# Altium project S7CAS-PLEIADES-CARTE-MERE_Pxx.PrjPcb (part 2 of 5)

## Sheet S7CAS-PLEIADES-CARTE-MERE_Pxx_DEBUG_USB.SchDoc
size Tabloid; SheetNumber: 8; SheetTotal: 17; Sheet_Name: DEBUG_USB; Size: 11x17
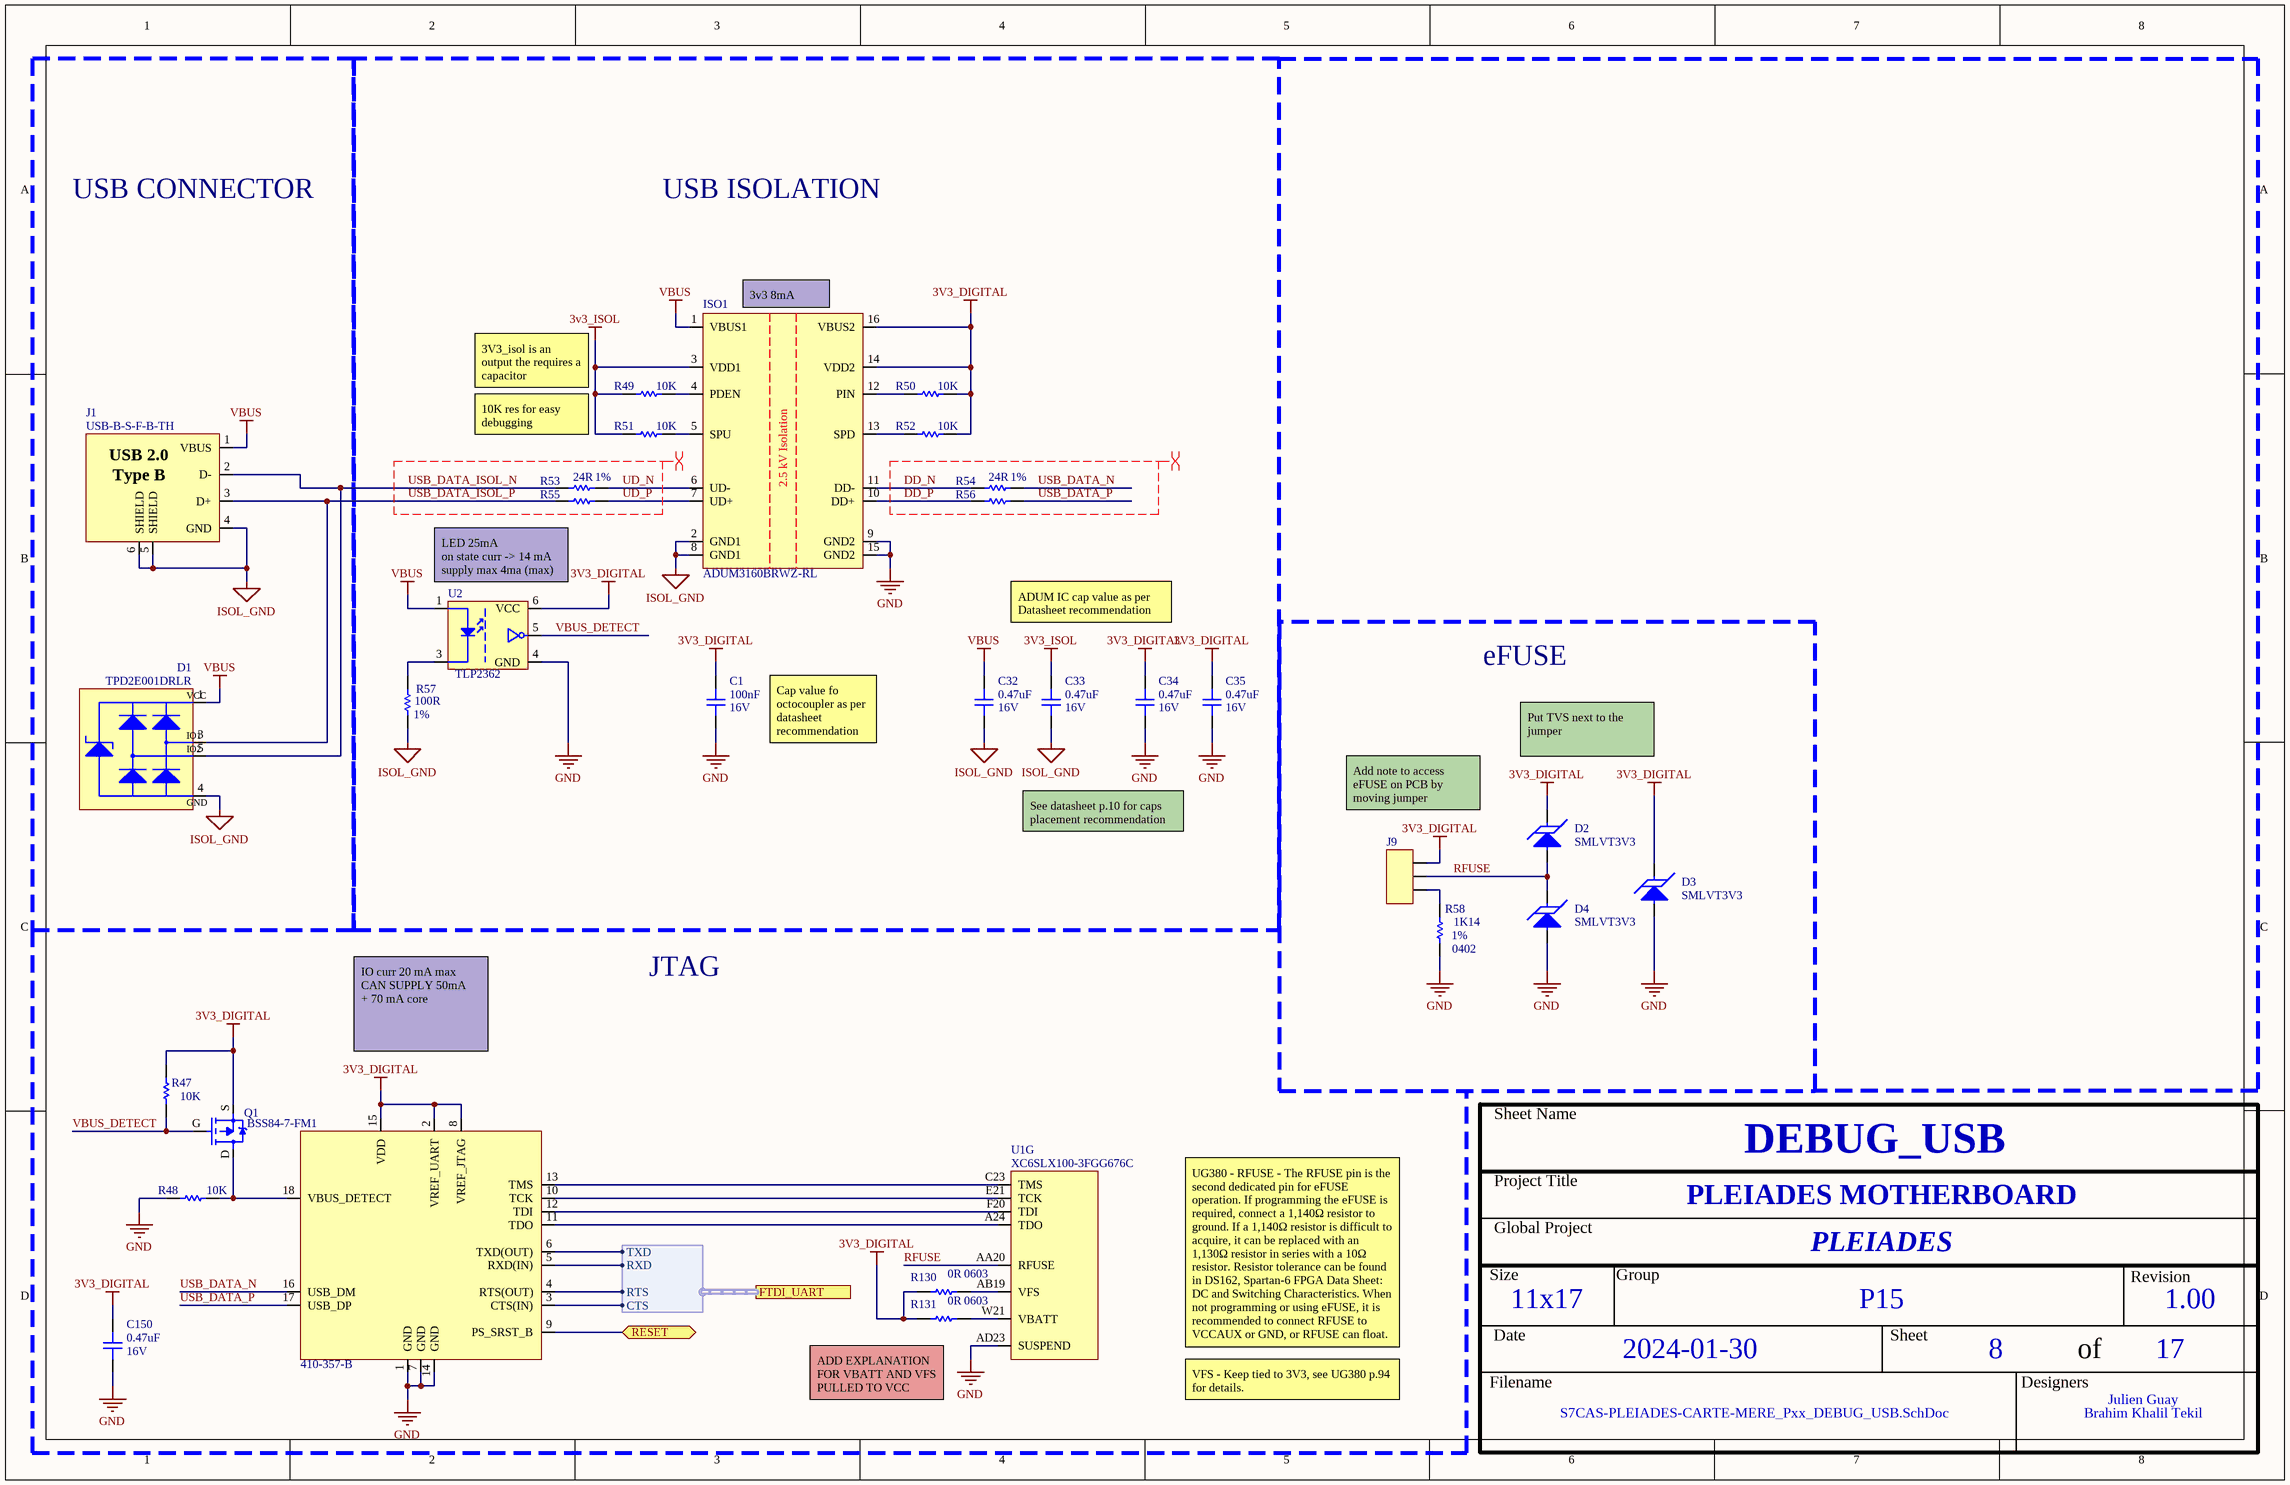
[diagram p6: S7CAS-PLEIADES-CARTE-MERE_Pxx_DEBUG_USB.SchDoc]

### Parts
C1  value 100nF  Voltage: 16V  [CAP_0603]  (hidden comment: CAP - 0603)
C32  value 0.47uF  Voltage: 16V  [CAP_0603]  (hidden comment: CAP - 0603)
C33  value 0.47uF  Voltage: 16V  [CAP_0603]  (hidden comment: CAP - 0603)
C34  value 0.47uF  Voltage: 16V  [CAP_0603]  (hidden comment: CAP - 0603)
C35  value 0.47uF  Voltage: 16V  [CAP_0603]  (hidden comment: CAP - 0603)
C150  value 0.47uF  Voltage: 16V  [CAP_0603]  (hidden comment: CAP - 0603)
D1  TPD2E001DRLR  [TVS_USB_TPD2E001DRLR]
D2  SMLVT3V3  [TVS_POW_SMLVT3V3]
D3  SMLVT3V3  [TVS_POW_SMLVT3V3]
D4  SMLVT3V3  [TVS_POW_SMLVT3V3]
ISO1  ADUM3160BRWZ-RL  [ISO_ADUM3160BRWZ-RL]
J1  USB-B-S-F-B-TH  [CON_USB_USB-B-S-F-B-TH]
J9  Part Number  [MALE HEADER - 1x3 2.54mm]  (value not drawn)
M1  410-357-B  [MOD_JTAG_410-357-B]
Q1  BSS84-7-F
R47  value 10K  [RES_0603]  (hidden comment: RES - 0603)
R48  value 10K  [RES_0603]  (hidden comment: RES - 0603)
R49  value 10K  [RES_0603]  (hidden comment: RES - 0603)
R50  value 10K  [RES_0603]  (hidden comment: RES - 0603)
R51  value 10K  [RES_0603]  (hidden comment: RES - 0603)
R52  value 10K  [RES_0603]  (hidden comment: RES - 0603)
R53  value 24R  Precision: 1%  [RES_0402]  (hidden comment: RES - 0402)
R54  value 24R  Precision: 1%  [RES_0402]  (hidden comment: RES - 0402)
R55  RES - 0402  [RES_0402]  (value not drawn)
R56  RES - 0402  [RES_0402]  (value not drawn)
R57  value 100R  Precision: 1%  [RES_0603]  (hidden comment: RES - 0603)
R58  value 1K14  Package: 0402  Precision: 1%  [RES_0402]  (hidden comment: RES - 0402)
R130  value 0R  Package: 0603  [RES_0603]  (hidden comment: RES - 0603)
R131  value 0R  Package: 0603  [RES_0603]  (hidden comment: RES - 0603)
U1  XC6SLX100-3FGG676C  [FPGA_XILINX_FGG676]  (part G of 10)
U2  TLP2362

### Blocks framed on the sheet
USB CONNECTOR: D1 J1
USB ISOLATION: C1 C32-C35 ISO1 R49-R57 U2
eFUSE: D2-D4 J9 R58

### Ports
FTDI_UART (harness FTDI_HARNESS, see S7CAS-PLEIADES-CARTE-MERE_Pxx_FPGA_bank2_4[6A]), RESET (bidir, see S7CAS-PLEIADES-CARTE-MERE_Pxx_FPGA_bank2_4[6C])

### Harnesses
FTDI_HARNESS: TXD, RXD, RTS, CTS

### Nets
3V3_DIGITAL: C1.2 C34.2 C35.2 C150.2 D2.K D3.K ISO1.14(VDD2) ISO1.16(VBUS2) J9.1 M1.2(VREF_UART) M1.8(VREF_JTAG) M1.15(VDD) Q1.S R47.2 R50.1 R52.1 R130.2 R131.2 U2.6(VCC)
3v3_ISOL: C33.2 ISO1.3(VDD1) R49.2 R51.2
GND: C1.1 C34.1 C35.1 C150.1 D3.A D4.A ISO1.9(GND2) ISO1.15(GND2) M1.1(GND) M1.7(GND) M1.14(GND) R48.1 R58.1 U1.AD23(SUSPEND) U2.4(GND)  [project net nCS]
ISOL_GND: C32.1 C33.1 D1.4(GND) ISO1.2(GND1) ISO1.8(GND1) J1.4(GND) J1.5(SHIELD) J1.6(SHIELD) R57.1
VBUS: C32.2 D1.1(VCC) ISO1.1(VBUS1) J1.1(VBUS) U2.1
DD_N: ISO1.11(DD-) R54.2
DD_P: ISO1.10(DD+) R56.2
PROGRAM_B: M1.9(PS_SRST_B) ; port RESET
RFUSE: D2.A D4.K J9.2 U1.AA20(RFUSE)
UD_N: ISO1.6(UD-) R53.1
UD_P: ISO1.7(UD+) R55.1
USB_DATA_ISOL_N: D1.5(IO2) J1.2(D-) R53.2
USB_DATA_ISOL_P: D1.3(IO1) J1.3(D+) R55.2
USB_DATA_N: M1.16(USB_DM) R54.1
USB_DATA_P: M1.17(USB_DP) R56.1
VBUS_DETECT: Q1.G R47.1 U2.5(vout)
NetISO1_4: ISO1.4(PDEN) R49.1
NetISO1_5: ISO1.5(SPU) R51.1
NetISO1_12: ISO1.12(PIN) R50.2
NetISO1_13: ISO1.13(SPD) R52.2
NetJ9_3: J9.3 R58.2
NetM1_3: M1.3(CTS(IN)) ; port FTDI_UART.CTS
NetM1_4: M1.4(RTS(OUT)) ; port FTDI_UART.RTS
NetM1_5: M1.5(RXD(IN)) ; port FTDI_UART.RXD
NetM1_6: M1.6(TXD(OUT)) ; port FTDI_UART.TXD
NetM1_10: M1.10(TCK) U1.E21(TCK)
NetM1_11: M1.11(TDO) U1.A24(TDO)
NetM1_12: M1.12(TDI) U1.F20(TDI)
NetM1_13: M1.13(TMS) U1.C23(TMS)
NetM1_18: M1.18(VBUS_DETECT) Q1.D R48.2
NetR57_2: R57.2 U2.3
NetR130_1: R130.1 U1.AB19(VFS)
NetR131_1: R131.1 U1.W21(VBATT)

Not connected (* = marked no-connect by the designer): D1 2(NC)

### Layout directives
differential pair; differential pair class USB_DATA_PAIR: UD_N, UD_P, USB_DATA_ISOL_N, USB_DATA_ISOL_P
differential pair: DD_N, DD_P, USB_DATA_N, USB_DATA_P

### Notes on the sheet
- (near ISO1) 3v3 8mA
- 3V3_isol is an output the requires a capacitor
- 10K res for easy debugging
- LED 25mA
  on state curr -> 14 mA
  supply max 4ma (max)
- ADUM IC cap value as per Datasheet recommendation
- Cap value fo octocoupler as per datasheet recommendation
- Put TVS next to the jumper
- See datasheet p.10 for caps placement recommendation
- Add note to access eFUSE on PCB by moving jumper
- JTAG
- IO curr 20 mA max
  CAN SUPPLY 50mA
  + 70 mA core
- UG380 - RFUSE - The RFUSE pin is the second dedicated pin for eFUSE operation. If programming the eFUSE is required, connect a 1,140Ω resistor to ground. If a 1,140Ω resistor is difficult to acquire, it can be replaced with an 1,130Ω resistor in series with a 10Ω resistor. Resistor tolerance can be found in DS162, Spartan-6 FPGA Data Sheet: DC and Switching Characteristics. When not programming or using eFUSE, it is recommended to connect RFUSE to VCCAUX or GND, or RFUSE can float.
- (near R131) ADD EXPLANATION FOR VBATT AND VFS PULLED TO VCC
- VFS - Keep tied to 3V3, see UG380 p.94 for details.
- Sheet Name
- Project Title
- Global Project
- Size
- Group
- Revision
- Date
- Sheet
- of
- Filename
- Designers
- (in symbol CON_USB_USB-B-S-F-B-TH) USB 2.0; Type B
- (in symbol ISO_ADUM3160BRWZ-RL) 2.5 kV Isolation

### Library data of the parts
C1 C32-C35 C150 = CAP - 0603: Precision: 10%; Current: *; CreatedBy: Jonathan Bouchard; Power: *; Package: 0603; Supplier 1: Arrow Electronics
  C1: Supplier Part Number 1: CL10B104KO8NNNC
  C32-C35 C150: Supplier Part Number 1: C1608X7R1C474K080AC
D1 = TVS_USB_TPD2E001DRLR: TVS - USB TVS DIODE 5.5V - SOT-553; Manufacturer #1: Texas Instruments; Value: 11V Breakdown; Voltage Rating: 5.5V (Max); GRAMS Lib Spec: 2.8; Magnetic Material: YES; Cryo: UNKNOWN; Tolerance: *; Current Rating: *; Power Max: *; HelpURL: http://www.ti.com/lit/ds/symlink/tpd2e001.pdf; CreatedBy/Date: Jonathan Bouchard 2018-07-10; VerifiedBy: Arnaud Samson 16-07-18; Temperature: -40°C ~ 85°C (TA); Package: SOT-553; Manufacturer #2: *; Note: *; Assembly Type: SMD; Part Number #2: *; Part Number #1: TPD2E001DRLR; Polarized: YES; Supplier 1: Digi-Key; Supplier Part Number 1: 296-21883-1-ND
D2-D4 = TVS_POW_SMLVT3V3: as D5 on sheet S7CAS-PLEIADES-CARTE-MERE_Pxx_FPGA_bank2_4; Tolerance: *; HelpURL: https://www.st.com/content/ccc/resource/technical/document/datasheet/da/a4/86/90/17/13/47/7c/CD00000923.pdf/files/CD00000923.pdf/jcr:content/translations/en.CD00000923.pdf; CreatedBy/Date: Jonathan Bouchard - 2019-04-27; VerifiedBy: Nicolas V. (2019-05-06); Temperature: -55°C ~ 175°C (TJ); Package: DO214AA; Manufacturer #2: *; Note: *; Assembly Type: SMD; Part Number #2: *; Part Number #1: SMLVT3V3; Supplier 1: Digi-Key; Supplier Part Number 1: 497-2496-1-ND; Cryo: UNKNOWN
ISO1 = ISO_ADUM3160BRWZ-RL: ISO - DGTL ISO 2.5KV 2CH USB - 16SOIC; Manufacturer #1: Analog Devices; Value: 2500Vrms voltage isolation; Voltage Rating: 3~5.5V; GRAMS Lib Spec: 2.8; Magnetic Material: UNKNOWN; Polarized: Yes; Tolerance: *; Current Rating: *; Power Max: *; HelpURL: https://www.analog.com/media/en/technical-documentation/data-sheets/ADuM3160.pdf; CreatedBy/Date: Tommy Rossignol 2018-11-16; VerifiedBy: Caroline Paulin - 13 février 2019; Temperature: -40°C ~ 105°C; Package: 16-SOIC; Manufacturer #2: *; Assembly Type: SMD; Part Number #2: *; Part Number #1: ADUM3160BRWZ-RL; Supplier 1: Digi-Key; Supplier Part Number 1: ADUM3160BRWZ-RLCT-ND; Cryo: UNKNOWN
J1 = CON_USB_USB-B-S-F-B-TH: CON - USB B RECPT TH R/A - 4-TH; Manufacturer #1: Samtec Inc.; Value: USB B; Voltage Rating: 30VAC; GRAMS Lib Spec: 2.8c; Magnetic Material: UNKNOWN; Polarized: YES; Tolerance: *; Current Rating: *; Power Max: *; HelpURL: http://suddendocs.samtec.com/catalog_english/usb_b.pdf; CreatedBy/Date: Jonathan Bouchard 2020-03-24; VerifiedBy: C.Paulin - 22/04/2020; Temperature: -50°C ~ 85°C; Package: 4-TH; Manufacturer #2: *; Note: *; Assembly Type: TH; Part Number #2: *; Part Number #1: USB-B-S-F-B-TH; Supplier 1: Digi-Key; Supplier Part Number 1: SAM10867-ND; Cryo: UNKNOWN
J9 = MALE HEADER - 1x3 2.54mm: MALE HEADER - 2.54mm 1x2; GRAMS Lib Spec: 2.7
M1 = MOD_JTAG_410-357-B: MOD - JTAG-SMT3-NC Programming Module For Xilinx FPGA - 18-SMT; Manufacturer #1: Digilent; Voltage Rating: VDD: 2.97V~3.63V, VJTAG/VUART: 1.65V~5.5V; GRAMS Lib Spec: 2.8; Note: Prior to reflow, the JTAG-SMT3-NC module must be dried at 125°C for 17 hours; Magnetic Material: Unknown; Polarized: Yes; Value: *; Tolerance: *; Current Rating: *; Power Max: *; HelpURL: https://reference.digilentinc.com/_media/reference/programmers/jtag-smt3/jtag-smt3-nc_rm.pdf; CreatedBy/Date: Tommy Rossignol 2018-11-23; VerifiedBy: Nicolas V. (2019-01-28); Temperature: -40°C ~ 85°C; Package: 18-pad SMT; Manufacturer #2: *; Assembly Type: SMD; Part Number #2: *; Part Number #1: 410-357-B; Supplier 1: Digi-Key; Supplier Part Number 1: 1286-1196-ND; Cryo: UNKNOWN
Q1 = MOS_P_CHANNEL: P-Channel  Enhancement Mode Field Effect Transistor; Current: [Current]; Mfr: *; Package / Case: *; Vds: *; Rds ON: *; Vgs: *; Operating Temperature: *; Supplier 1: Future Electronics; Supplier Part Number 1: 2984037
R47-R52 R130 R131 = RES - 0603: Precision: 1%; Current: *; CreatedBy: Jonathan Bouchard; Supplier 1: Arrow Electronics
  R47-R52: Package: 0603; Supplier Part Number 1: RMCF0603FT10K0
  R130 R131: Supplier Part Number 1: RMCF0603ZT0R00
R53 R54 R58 = RES - 0402: Voltage: 50V; Power: 1/16W; Current: *; CreatedBy: Jonathan Bouchard
  R53 R54: Package: 0402; Supplier 1: Arrow Electronics; Supplier Part Number 1: RC0402FR-0724RL
  R58: Supplier 1: Digikey; Supplier Part Number 1: 2019-RN73H1ETTP1141F50CT-ND
R55 R56 = RES - 0402: Voltage: 50V; Power: 1/16W; Precision: 1%; Value: 24R; Current: *; CreatedBy: Jonathan Bouchard; Package: 0402; Supplier 1: Arrow Electronics; Supplier Part Number 1: RC0402FR-0724RL
U1 = FPGA_XC6SLX100-3FGG676C: FPGA - XILINX SPARTAN 6 480 I/O - BGA-676; Voltage: 1.14 V ~ 1.26 V; Current: *; Power: *; Mfg: Xilinx; Mfg Part Number: XC6SLX100-3FGG676C; HelpURL: https://www.xilinx.com/support/documentation/data_sheets/ds162.pdf; CreatedBy: Jonathan Bouchard; Temperature: 0°C ~ 85°C (TJ); Value: *; Precision: *; Package: BGA-676; Supplier 1: Digikey; Supplier Part Number 1: 122-1760-ND
U2 = PHOTO_COUP_TLP2362: ISO - Logic Output Optoisolator 10MBd Open Collector 3750Vrms 1 Channel 20kV/µs CMTI 6-SO, 5 Lead; GRAMS Lib Spec: 2.7; Supplier 1: Arrow Electronics; Supplier Part Number 1: TLP2362(TPR,E
R57 = RES - 0603: Current: *; CreatedBy: Jonathan Bouchard; Package: 0603; Supplier 1: Arrow Electronics; Supplier Part Number 1: RMCF0603FT100R

## Sheet S7CAS-PLEIADES-CARTE-MERE_Pxx_PHY.SchDoc
size Tabloid; SheetNumber: 9; SheetTotal: 17; Sheet_Name: PHY; Size: 11x17
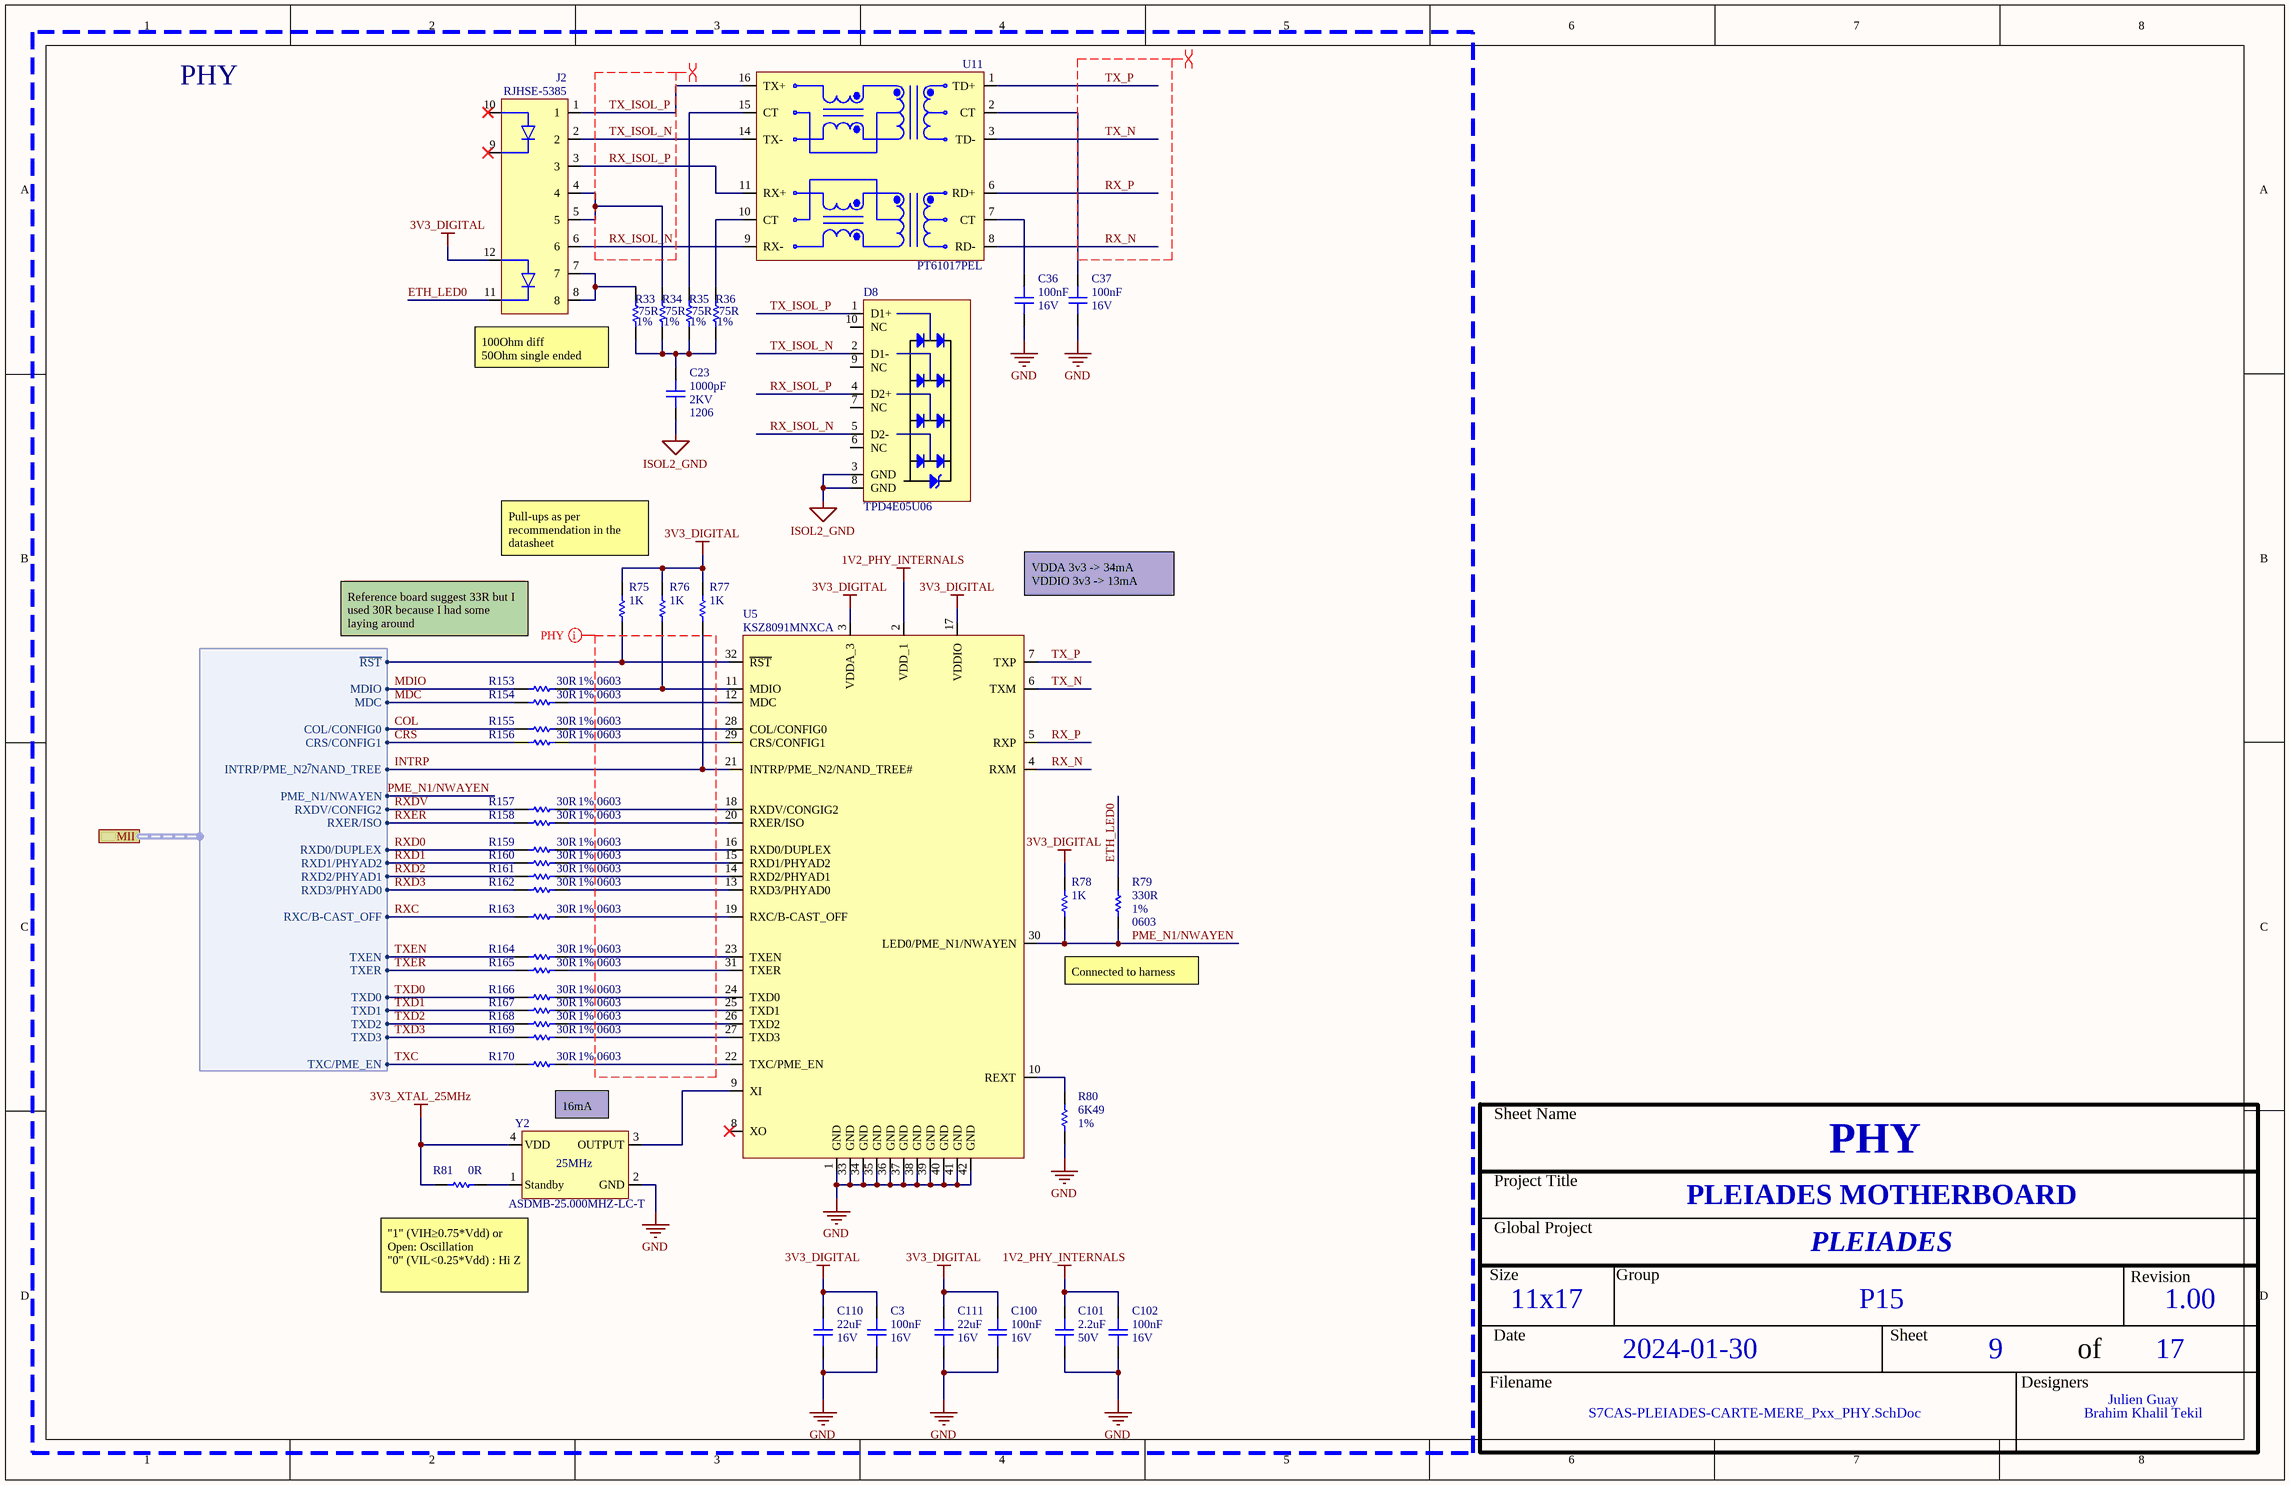
[diagram p7: S7CAS-PLEIADES-CARTE-MERE_Pxx_PHY.SchDoc]

### Parts
C3  value 100nF  Voltage: 16V  [CAP_0603]  (hidden comment: CAP - 0603)
C23  value 1000pF  Voltage: 2KV  Package: 1206  [CAP_1206]  (hidden comment: CAP - 1206)
C36  value 100nF  Voltage: 16V  [CAP_0603]  (hidden comment: CAP - 0603)
C37  value 100nF  Voltage: 16V  [CAP_0603]  (hidden comment: CAP - 0603)
C100  value 100nF  Voltage: 16V  [CAP_0603]  (hidden comment: CAP - 0603)
C101  value 2.2uF  Voltage: 50V  [CAP_0603]  (hidden comment: CAP - 0603)
C102  value 100nF  Voltage: 16V  [CAP_0603]  (hidden comment: CAP - 0603)
C110  value 22uF  Voltage: 16V  [CAP_1206]  (hidden comment: CAP - 1206)
C111  value 22uF  Voltage: 16V  [CAP_1206]  (hidden comment: CAP - 1206)
D8  TPD4E05U06  [TVS_DATA_TPD4E05U06]
J2  RJHSE-5385  [CONN_ETHERNET_RJHSE-5385]
R33  value 75R  Precision: 1%  [RES_0603]  (hidden comment: RES - 0603)
R34  value 75R  Precision: 1%  [RES_0603]  (hidden comment: RES - 0603)
R35  value 75R  Precision: 1%  [RES_0603]  (hidden comment: RES - 0603)
R36  value 75R  Precision: 1%  [RES_0603]  (hidden comment: RES - 0603)
R75  value 1K  [RES_0603]  (hidden comment: RES - 0603)
R76  value 1K  [RES_0603]  (hidden comment: RES - 0603)
R77  value 1K  [RES_0603]  (hidden comment: RES - 0603)
R78  value 1K  [RES_0603]  (hidden comment: RES - 0603)
R79  value 330R  Package: 0603  Precision: 1%  [RES_0603]  (hidden comment: RES - 0603)
R80  value 6K49  Precision: 1%  [RES_0402]  (hidden comment: RES - 0402)
R81  value 0R  [RES_0603]  (hidden comment: RES - 0603)
R153  value 30R  Package: 0603  Precision: 1%  [RES_0603]  (hidden comment: RES - 0603)
R154  value 30R  Package: 0603  Precision: 1%  [RES_0603]  (hidden comment: RES - 0603)
R155  value 30R  Package: 0603  Precision: 1%  [RES_0603]  (hidden comment: RES - 0603)
R156  value 30R  Package: 0603  Precision: 1%  [RES_0603]  (hidden comment: RES - 0603)
R157  value 30R  Package: 0603  Precision: 1%  [RES_0603]  (hidden comment: RES - 0603)
R158  value 30R  Package: 0603  Precision: 1%  [RES_0603]  (hidden comment: RES - 0603)
R159  value 30R  Package: 0603  Precision: 1%  [RES_0603]  (hidden comment: RES - 0603)
R160  value 30R  Package: 0603  Precision: 1%  [RES_0603]  (hidden comment: RES - 0603)
R161  value 30R  Package: 0603  Precision: 1%  [RES_0603]  (hidden comment: RES - 0603)
R162  value 30R  Package: 0603  Precision: 1%  [RES_0603]  (hidden comment: RES - 0603)
R163  value 30R  Package: 0603  Precision: 1%  [RES_0603]  (hidden comment: RES - 0603)
R164  value 30R  Package: 0603  Precision: 1%  [RES_0603]  (hidden comment: RES - 0603)
R165  value 30R  Package: 0603  Precision: 1%  [RES_0603]  (hidden comment: RES - 0603)
R166  value 30R  Package: 0603  Precision: 1%  [RES_0603]  (hidden comment: RES - 0603)
R167  value 30R  Package: 0603  Precision: 1%  [RES_0603]  (hidden comment: RES - 0603)
R168  value 30R  Package: 0603  Precision: 1%  [RES_0603]  (hidden comment: RES - 0603)
R169  value 30R  Package: 0603  Precision: 1%  [RES_0603]  (hidden comment: RES - 0603)
R170  value 30R  Package: 0603  Precision: 1%  [RES_0603]  (hidden comment: RES - 0603)
U5  KSZ8091MNXCA  [COM_ETH_PHY_KSZ8091MNXCA]
U11  PT61017PEL  [ISO_PT61017PEL]
Y2  ASDMB-25.000MHZ-LC-T  [OSC_ASDMB-25.000MHZ-LC-T]

### Blocks framed on the sheet
PHY: C3 C23 C36 C37 C100-C102 C110 C111 D8 J2 R33-R36 R75-R81 R153-R170 U5 U11 Y2

### Ports
MII (harness MII - Harness, see S7CAS-PLEIADES-CARTE-MERE_Pxx_FPGA_bank0_1_5[1B])

### Harnesses
MII - Harness: ~{RST}, MDIO, MDC, COL/CONFIG0, CRS/CONFIG1, INTRP/PME_N2~{/}NAND_TREE, PME_N1/NWAYEN, RXDV/CONFIG2, RXER/ISO, RXD0/DUPLEX, RXD1/PHYAD2, RXD2/PHYAD1, RXD3/PHYAD0, RXC/B-CAST_OFF, TXEN, TXER, TXD0, TXD1, TXD2, TXD3, TXC/PME_EN

### Nets
1V2_PHY_INTERNALS: C101.2 C102.2 U5.2(VDD_1)
3V3_DIGITAL: C3.2 C100.2 C110.2 C111.2 J2.12(LED2_A) R75.2 R76.2 R77.2 R78.2 U5.3(VDDA_3) U5.17(VDDIO)
3V3_XTAL_25MHz: R81.2 Y2.4(VDD)
GND: C3.1 C36.1 C37.1 C100.1 C101.1 C102.1 C110.1 C111.1 R80.1 U5.1(GND) U5.33(GND) U5.34(GND) U5.35(GND) U5.36(GND) U5.37(GND) U5.38(GND) U5.39(GND) U5.40(GND) U5.41(GND) U5.42(GND) Y2.2(GND)  [project net nCS]
ISOL2_GND: C23.1 D8.3(GND) D8.8(GND)
COL: R155.1 ; port MII.COL/CONFIG0
CRS: R156.1 ; port MII.CRS/CONFIG1
ETH_LED0: J2.11(LED2_K) R79.2
INTRP: R77.1 U5.21(INTRP/PME_N2/NAND_TREE#) ; port MII.INTRP/PME_N2~{/}NAND_TREE
MDC: R154.1 ; port MII.MDC
MDIO: R153.1 ; port MII.MDIO
PME_N1/NWAYEN: R78.1 R79.1 U5.30(LED0/PME_N1/NWAYEN) ; port MII.PME_N1/NWAYEN
RX_ISOL_N: D8.5(D2-) J2.6 U11.9(RX-)
RX_ISOL_P: D8.4(D2+) J2.3 U11.11(RX+)
RX_N: U5.4(RXM) U11.8(RD-)
RX_P: U5.5(RXP) U11.6(RD+)
RXC: R163.1 ; port MII.RXC/B-CAST_OFF
RXD0: R159.1 ; port MII.RXD0/DUPLEX
RXD1: R160.1 ; port MII.RXD1/PHYAD2
RXD2: R161.1 ; port MII.RXD2/PHYAD1
RXD3: R162.1 ; port MII.RXD3/PHYAD0
RXDV: R157.1 ; port MII.RXDV/CONFIG2
RXER: R158.1 ; port MII.RXER/ISO
TX_ISOL_N: D8.2(D1-) J2.2 U11.14(TX-)
TX_ISOL_P: D8.1(D1+) J2.1 U11.16(TX+)
TX_N: U5.6(TXM) U11.3(TD-)
TX_P: U5.7(TXP) U11.1(TD+)
TXC: R170.1 ; port MII.TXC/PME_EN
TXD0: R166.1 ; port MII.TXD0
TXD1: R167.1 ; port MII.TXD1
TXD2: R168.1 ; port MII.TXD2
TXD3: R169.1 ; port MII.TXD3
TXEN: R164.1 ; port MII.TXEN
TXER: R165.1 ; port MII.TXER
NetC23_2: C23.2 R33.1 R34.1 R35.1 R36.1
NetC36_2: C36.2 U11.7(CT)
NetC37_2: C37.2 U11.2(CT)
NetJ2_4: J2.4 J2.5 R34.2
NetJ2_7: J2.7 J2.8 R33.2
NetR35_2: R35.2 U11.15(CT)
NetR36_2: R36.2 U11.10(CT)
NetR75_1: R75.1 U5.32(~{RST}) ; port MII.~{RST}
NetR76_1: R76.1 R153.2 U5.11(MDIO)
NetR80_2: R80.2 U5.10(REXT)
NetR81_1: R81.1 Y2.1(Standby)
NetR154_2: R154.2 U5.12(MDC)
NetR155_2: R155.2 U5.28(COL/CONFIG0)
NetR156_2: R156.2 U5.29(CRS/CONFIG1)
NetR157_2: R157.2 U5.18(RXDV/CONGIG2)
NetR158_2: R158.2 U5.20(RXER/ISO)
NetR159_2: R159.2 U5.16(RXD0/DUPLEX)
NetR160_2: R160.2 U5.15(RXD1/PHYAD2)
NetR161_2: R161.2 U5.14(RXD2/PHYAD1)
NetR162_2: R162.2 U5.13(RXD3/PHYAD0)
NetR163_2: R163.2 U5.19(RXC/B-CAST_OFF)
NetR164_2: R164.2 U5.23(TXEN)
NetR165_2: R165.2 U5.31(TXER)
NetR166_2: R166.2 U5.24(TXD0)
NetR167_2: R167.2 U5.25(TXD1)
NetR168_2: R168.2 U5.26(TXD2)
NetR169_2: R169.2 U5.27(TXD3)
NetR170_2: R170.2 U5.22(TXC/PME_EN)
NetU5_9: U5.9(XI) Y2.3(OUTPUT)

Not connected (* = marked no-connect by the designer): D8 6(NC) 7(NC) 9(NC) 10(NC); J2 9(LED1_K)* 10(LED1_A)*; U5 8(XO)*

### Layout directives
differential pair; differential pair class ETH_DIFF_PAIR: RX_N, RX_P, TX_N, TX_P
differential pair; differential pair class ETH_ISOL_DIFF_PAIR: RX_ISOL_N, RX_ISOL_P, TX_ISOL_N, TX_ISOL_P
net class MII_TRANSMISSION_LINE: (no net found under the mark)

### Notes on the sheet
- 100Ohm diff
  50Ohm single ended
- Pull-ups as per recommendation in the datasheet
- Reference board suggest 33R but I used 30R because I had some laying around
- (near U5) VDDA 3v3 -> 34mA
  VDDIO 3v3 -> 13mA
- Connected to harness
- 16mA
- "1" (VIH≥0.75*Vdd) or Open: Oscillation
  "0" (VIL<0.25*Vdd) : Hi Z
- Sheet Name
- Project Title
- Global Project
- Size
- Group
- Revision
- Date
- Sheet
- of
- Filename
- Designers

### Library data of the parts
C3 C36 C37 C100-C102 = CAP - 0603: Precision: 10%; Current: *; CreatedBy: Jonathan Bouchard; Power: *; Package: 0603; Supplier 1: Arrow Electronics
  C3 C36 C37 C100 C102: Supplier Part Number 1: CL10B104KO8NNNC
  C101: Supplier Part Number 1: GRM188R61H225KE11D
C23 C110 C111 = CAP - 1206: Precision: 10%; Current: *; CreatedBy: Jonathan Bouchard; Power: *; Supplier 1: Arrow Electronics
  C23: Supplier Part Number 1: 1206GC102KAT1A
  C110 C111: Package: 1206; Supplier Part Number 1: CL31A226MOCLNNC
D8 = TVS_DATA_TPD4E05U06: TVS - TVS DIODE 5.5VWM 14VC - 10SON; Manufacturer #1: Texas Instruments; Part Number #1: TPD4E05U06DQAR; Current Rating: 2.5A (8/20µs); Power Max: 40 W (peak); Value: 4 unidirectionnal channels; Voltage rating: 6V (Breakdown); Polarized: YES; Magnetic Material: UNKNOWN; GRAMS Lib Spec: 2.8; Manufacturer #2: *; Part Number #2: *; HelpURL: http://www.ti.com/lit/ds/symlink/tpd4e05u06.pdf; Supplier 1: Digi-Key; Supplier Part Number 1: 296-35765-1-ND; Note: *; Assembly Type: SMD; Temperature: -40°C ~ 125°C; Package: 10-USON; CreatedBy/Date: Olivier Bernard / 12/3/2018; Tolerance: *; VerifiedBy: Caroline Paulin / 4 juillet 2018; Cryo: UNKNOWN
J2 = CONN_ETHERNET_RJHSE-5385: CONN - MOD JACK RJ45 R/A ETHERNET - TH; Mfg: Amphenol; Voltage: *; Current: *; Power: *; Mfg Part Number: RJHSE-5385; HelpURL: https://www.amphenolcanada.com/ProductSearch/drawings/AC/RJHSE538X.pdf; CreatedBy: Jonathan Bouchard; Temperature: -55°C ~ 85°C; Value: *; Precision: *; Package: TH-12; Supplier 1: Digikey; Supplier Part Number 1: RJHSE-5385-ND
R75-R78 R81 = RES - 0603: Precision: 1%; Current: *; CreatedBy: Jonathan Bouchard; Package: 0603; Supplier 1: Arrow Electronics
  R75-R78: Supplier Part Number 1: RMCF0603FT1K00
  R81: Supplier Part Number 1: RMCF0603ZT0R00
R80 = RES - 0402: Voltage: 50V; Power: 1/16W; Current: *; CreatedBy: Jonathan Bouchard; Package: 0402; Supplier 1: Mouser; Supplier Part Number 1: 652-CR0402-FX6491GLF
U5 = COM_ETH_PHY_KSZ8091MNXCA: COM - ETHERNET PHY 10/100 - QFN-32; Voltage: 1.8V, 2.5V, 3.3V; Mfg: Micrel; Current: *; Power: *; Mfg Part Number: KSZ8091MNXCA; HelpURL: http://ww1.microchip.com/downloads/en/DeviceDoc/00002275A.pdf; CreatedBy: Jonathan Bouchard; Temperature: 0°C ~ 70°C; Value: *; Precision: *; Package: QFN-32; Supplier 1: Digikey; Supplier Part Number 1: 576-4356-ND
U11 = ISO_PT61017PEL: ISO - 350µH LAN 10/100 Base-T Pulse Transformer 1CT:1CT Surface Mount; GRAMS Lib Spec: 2.7; Supplier 1: Arrow Electronics; Supplier Part Number 1: PT61017PEL
Y2 = OSC_ASDMB-25.000MHZ-LC-T: OSC - 25MHz XO (Standard) LVCMOS - 4-SMD, No Lead; Manufacturer #1: Abracon LLC; Tolerance: ±50ppm; Voltage Rating: 1.8V ~ 3.3V; GRAMS Lib Spec: 2.8; Magnetic Material: Unknown; Polarized: Yes; Value: 25MHz; Current Rating: *; Power Max: *; HelpURL: https://abracon.com/Oscillators/ASDMB.pdf; CreatedBy/Date: Joël Lemay 2019-03-29; VerifiedBy: C. Paulin - 29 mai 2019; Temperature: -40°C ~ +85°C; Package: 4-SMD, No Lead; Manufacturer #2: *; Note: *; Assembly Type: SMD; Part Number #2: *; Part Number #1: ASDMB-25.000MHZ-LC-T; Supplier 1: Digi-Key; Supplier Part Number 1: 535-11730-1-ND; Cryo: UNKNOWN
R33-R36 R79 R153-R170 = RES - 0603: Current: *; CreatedBy: Jonathan Bouchard
  R33-R36: Package: 0603; Supplier 1: Arrow Electronics; Supplier Part Number 1: RMCF0603FT75R0
  R153-R170: Supplier 1: Arrow Electronics; Supplier Part Number 1: RMCF0603FT30R0

## Sheet S7CAS-PLEIADES-CARTE-MERE_Pxx_FLASH_PHY_CLOCK.SchDoc
size Tabloid; SheetNumber: 10; SheetTotal: 18; Sheet_Name: FLASH CLOCK; Size: 11x17
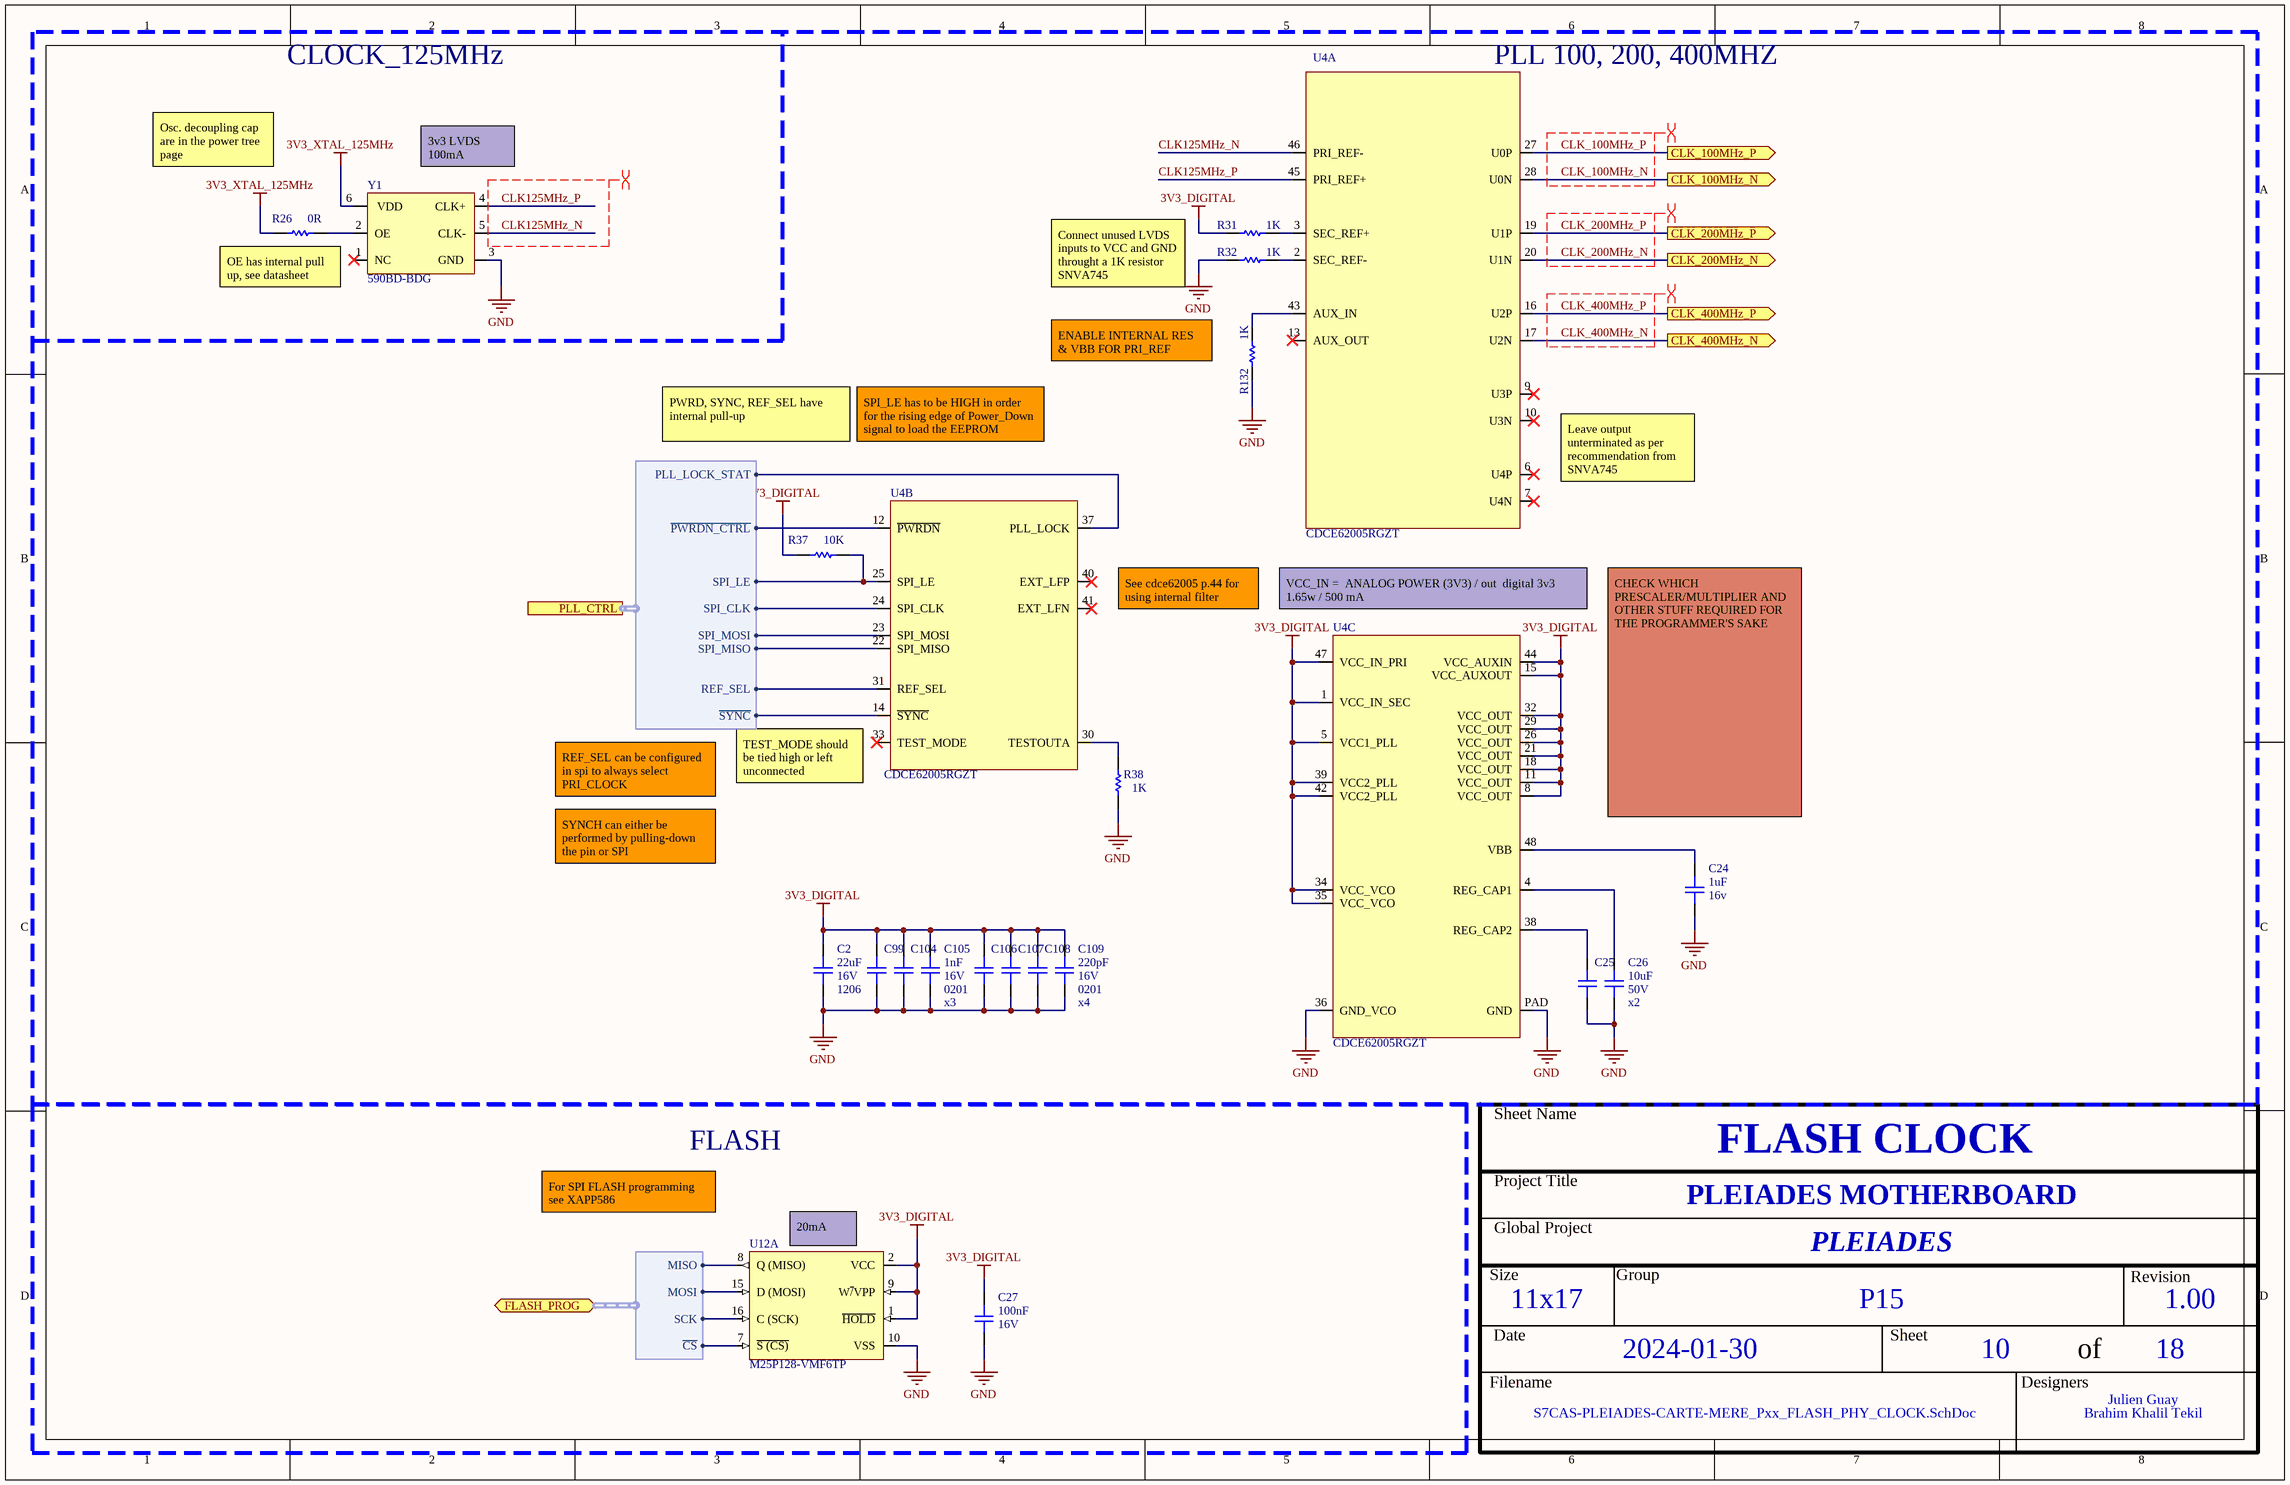
[diagram p8: S7CAS-PLEIADES-CARTE-MERE_Pxx_FLASH_PHY_CLOCK.SchDoc]

### Parts
C2  value 22uF  Voltage: 16V  Package: 1206  [CAP_1206]  (hidden comment: CAP - 1206)
C24  value 1uF  Voltage: 16v  [CAP_0603]  (hidden comment: CAP - 0603)
C25  CAP - 1206  [CAP_1206]  (value not drawn)
C26  value 10uF  Voltage: 50V  [CAP_1206]  (hidden comment: CAP - 1206)
C27  value 100nF  Voltage: 16V  [CAP_0603]  (hidden comment: CAP - 0603)
C99  CAP - 0201  [CAP_0201]  (value not drawn)
C104  CAP - 0201  [CAP_0201]  (value not drawn)
C105  value 1nF  Voltage: 16V  Package: 0201  [CAP_0201]  (hidden comment: CAP - 0201)
C106  CAP - 0201  [CAP_0201]  (value not drawn)
C107  CAP - 0201  [CAP_0201]  (value not drawn)
C108  CAP - 0201  [CAP_0201]  (value not drawn)
C109  value 220pF  Voltage: 16V  Package: 0201  [CAP_0201]  (hidden comment: CAP - 0201)
R26  value 0R  [RES_0603]  (hidden comment: RES - 0603)
R31  value 1K  [RES_0603]  (hidden comment: RES - 0603)
R32  value 1K  [RES_0603]  (hidden comment: RES - 0603)
R37  value 10K  [RES_0603]  (hidden comment: RES - 0603)
R38  value 1K  [RES_0603]  (hidden comment: RES - 0603)
R132  value 1K  [RES_0603]  (hidden comment: RES - 0603)
U4  CDCE62005RGZT  [TIM_CDCE62005RGZT]  (parts A,B,C of 3)
U12  M25P128-VMF6TP  [FLASH - M25P128-VMF6TP]  (part A of 2)
Y1  590BD-BDG  [OSC_590BD-BDG]

### Blocks framed on the sheet
FLASH: C27 U12

### Ports
CLK_100MHz_N (out, see S7CAS-PLEIADES-CARTE-MERE_Pxx_FPGA_bank0_1_5[3A]), CLK_100MHz_P (out, see S7CAS-PLEIADES-CARTE-MERE_Pxx_FPGA_bank0_1_5[3A]), CLK_200MHz_N (out, see S7CAS-PLEIADES-CARTE-MERE_Pxx_CAN[1C]), CLK_200MHz_P (out, see S7CAS-PLEIADES-CARTE-MERE_Pxx_CAN[1C]), CLK_400MHz_N (out, see S7CAS-PLEIADES-CARTE-MERE_Pxx_CNA[2C]), CLK_400MHz_P (out, see S7CAS-PLEIADES-CARTE-MERE_Pxx_CNA[2C]), FLASH_PROG (bidir, harness FLASH_PROG, see S7CAS-PLEIADES-CARTE-MERE_Pxx_FPGA_bank2_4[2D]), PLL_CTRL (harness PLL_CTRL, see S7CAS-PLEIADES-CARTE-MERE_Pxx_FPGA_bank0_1_5[1B])

### Harnesses
PLL_CTRL: ~{PWRDN_CTRL}, SPI_LE, SPI_CLK, SPI_MOSI, SPI_MISO, REF_SEL, ~{SYNC}, PLL_LOCK_STAT
FLASH_PROG: MISO, MOSI, SCK, ~{CS}

### Nets
3V3_DIGITAL: C2.2 C27.2 C99.2 C104.2 C105.2 C106.2 C107.2 C108.2 C109.2 R31.2 R37.2 U4.1(VCC_IN_SEC) U4.5(VCC1_PLL) U4.8(VCC_OUT) U4.11(VCC_OUT) U4.15(VCC_AUXOUT) U4.18(VCC_OUT) U4.21(VCC_OUT) U4.26(VCC_OUT) U4.29(VCC_OUT) U4.32(VCC_OUT) U4.34(VCC_VCO) U4.35(VCC_VCO) U4.39(VCC2_PLL) U4.42(VCC2_PLL) U4.44(VCC_AUXIN) U4.47(VCC_IN_PRI) U12.1(~{HOLD}) U12.2(VCC) U12.9(W~{/}VPP)
3V3_XTAL_125MHz: R26.2 Y1.6(VDD)
GND: C2.1 C24.1 C25.1 C26.1 C27.1 C99.1 C104.1 C105.1 C106.1 C107.1 C108.1 C109.1 R32.2 R38.1 R132.2 U4.36(GND_VCO) U4.PAD(GND) U12.10(VSS) Y1.3(GND)  [project net nCS]
CCLK: U12.16(C_(SCK)) ; port FLASH_PROG.SCK
CLK125MHz_N: U4.46(PRI_REF-) Y1.5(CLK-)
CLK125MHz_P: U4.45(PRI_REF+) Y1.4(CLK+)
CLK_100MHz_N: U4.28(U0N) ; port CLK_100MHz_N
CLK_100MHz_P: U4.27(U0P) ; port CLK_100MHz_P
CLK_200MHz_N: U4.20(U1N) ; port CLK_200MHz_N
CLK_200MHz_P: U4.19(U1P) ; port CLK_200MHz_P
CLK_400MHz_N: U4.17(U2N) ; port CLK_400MHz_N
CLK_400MHz_P: U4.16(U2P) ; port CLK_400MHz_P
CSO_B: U12.7(~{S_(CS)}) ; port FLASH_PROG.~{CS}
MOSI: U12.15(D_(MOSI)) ; port FLASH_PROG.MOSI
NetC24_2: C24.2 U4.48(VBB)
NetC25_2: C25.2 U4.38(REG_CAP2)
NetC26_2: C26.2 U4.4(REG_CAP1)
NetR26_1: R26.1 Y1.2(OE)
NetR31_1: R31.1 U4.3(SEC_REF+)
NetR32_1: R32.1 U4.2(SEC_REF-)
NetR37_1: R37.1 U4.25(SPI_LE) ; port PLL_CTRL.SPI_LE
NetR38_2: R38.2 U4.30(TESTOUTA)
NetR67_1: U12.8(Q_(MISO)) ; port FLASH_PROG.MISO
NetR132_1: R132.1 U4.43(AUX_IN)
NetU1_B8: U4.14(~{SYNC}) ; port PLL_CTRL.~{SYNC}
NetU1_C6: U4.37(PLL_LOCK) ; port PLL_CTRL.PLL_LOCK_STAT
NetU1_C8: U4.23(SPI_MOSI) ; port PLL_CTRL.SPI_MOSI
NetU1_D8: U4.24(SPI_CLK) ; port PLL_CTRL.SPI_CLK
NetU1_E8: U4.12(~{PWRDN}) ; port PLL_CTRL.~{PWRDN_CTRL}
NetU1_E9: U4.31(REF_SEL) ; port PLL_CTRL.REF_SEL
NetU1_F9: U4.22(SPI_MISO) ; port PLL_CTRL.SPI_MISO

Not connected (* = marked no-connect by the designer): U4 6(U4P)* 7(U4N)* 9(U3P)* 10(U3N)* 13(AUX_OUT)* 33(TEST_MODE)* 40(EXT_LFP)* 41(EXT_LFN)*; Y1 1(NC)*

### Layout directives
differential pair; differential pair class LVDS_125MHz; net class CLK_125MHz: CLK125MHz_N, CLK125MHz_P
differential pair; differential pair class CLK_100MHz_PAIR: CLK_100MHz_N, CLK_100MHz_P
differential pair; differential pair class CLK_200MHz_PAIR: CLK_200MHz_N, CLK_200MHz_P
differential pair; differential pair class CLK_400MHz_PAIR: CLK_400MHz_N, CLK_400MHz_P

### Notes on the sheet
- CLOCK_125MHz
- PLL 100, 200, 400MHZ
- Osc. decoupling cap are in the power tree page
- (near Y1) 3v3 LVDS 100mA
- (near R26) OE has internal pull up, see datasheet
- Connect unused LVDS inputs to VCC and GND throught a 1K resistor
  SNVA745
- (near R132) ENABLE INTERNAL RES & VBB FOR PRI_REF
- PWRD, SYNC, REF_SEL have internal pull-up
- SPI_LE has to be HIGH in order for the rising edge of Power_Down signal to load the EEPROM
- (near U4) Leave output unterminated as per recommendation from SNVA745
- (near U4) See cdce62005 p.44 for using internal filter
- VCC_IN =  ANALOG POWER (3V3) / out  digital 3v3
  1.65w / 500 mA
- REF_SEL can be configured in spi to always select PRI_CLOCK
- (near U4) TEST_MODE should be tied high or left unconnected
- CHECK WHICH PRESCALER/MULTIPLIER AND OTHER STUFF REQUIRED FOR THE PROGRAMMER'S SAKE
- SYNCH can either be performed by pulling-down the pin or SPI
- x3
- (near C109) x4
- (near C26) x2
- For SPI FLASH programming see XAPP586
- (near U12) 20mA
- Sheet Name
- Project Title
- Global Project
- Size
- Group
- Revision
- Date
- Sheet
- of
- Filename
- Designers

### Library data of the parts
C2 C26 = CAP - 1206: Precision: 10%; Current: *; CreatedBy: Jonathan Bouchard; Power: *
  C2: Supplier 1: Arrow Electronics; Supplier Part Number 1: CL31A226MOCLNNC
  C26: Package: 1206; Supplier 1: Avnet; Supplier Part Number 1: CL31A106MBHNNNE
C24 C27 = CAP - 0603: Precision: 10%; Current: *; CreatedBy: Jonathan Bouchard; Power: *; Package: 0603; Supplier 1: Arrow Electronics
  C24: Supplier Part Number 1: CL10B105MO8NNWC
  C27: Supplier Part Number 1: CL10B104KO8NNNC
C25 = CAP - 1206: Precision: 10%; Voltage: 50V; Value: 10uF; Current: *; CreatedBy: Jonathan Bouchard; Power: *; Package: 1206; Supplier 1: Avnet; Supplier Part Number 1: CL31A106MBHNNNE
C99 C104 = CAP - 0201: Precision: 10%; Voltage: 16V; Value: 1nF; Current: *; CreatedBy: Jonathan Bouchard; Power: *; Package: 0201; Supplier 1: Avnet; Supplier Part Number 1: GRM033R71C102KA01J
C105 C109 = CAP - 0201: Precision: 10%; Current: *; CreatedBy: Jonathan Bouchard; Power: *
  C105: Supplier 1: Avnet; Supplier Part Number 1: GRM033R71C102KA01J
  C109: Supplier 1: Arrow Electronics; Supplier Part Number 1: GRM033R71C221KA01D
C106-C108 = CAP - 0201: Precision: 10%; Voltage: 16V; Value: 220pF; Current: *; CreatedBy: Jonathan Bouchard; Power: *; Package: 0201; Supplier 1: Arrow Electronics; Supplier Part Number 1: GRM033R71C221KA01D
R26 R31 R32 R37 R38 R132 = RES - 0603: Precision: 1%; Current: *; CreatedBy: Jonathan Bouchard; Package: 0603
  R26: Supplier 1: Arrow Electronics; Supplier Part Number 1: RMCF0603ZT0R00
  R31 R32 R132: Supplier 1: Mouser; Supplier Part Number 1: 71-CRCW0603-10K-E3
  R37: Supplier 1: Arrow Electronics; Supplier Part Number 1: RMCF0603FT10K0
  R38: Supplier 1: Arrow Electronics; Supplier Part Number 1: RMCF0603FT1K00
U4 = TIM_CDCE62005RGZT: TIM - CLK SYNTH JITTER CLEANER 3:5 - QFN-48; Voltage: 3 V ~ 3.6 V; Mfg: Texas Instruments; Current: *; Power: *; Mfg Part Number: CDCE62005RGZT; HelpURL: http://www.ti.com/lit/ds/symlink/cdce62005.pdf; CreatedBy: Jonathan Bouchard; Temperature: -40°C ~ 85°C; Value: *; Precision: *; Package: QFN-48; Supplier 1: Digikey; Supplier Part Number 1: 296-23947-1-ND
U12 = FLASH  - M25P128-VMF6TP: 128-Mbit, low-voltage, serial flash memory / with 54-MHz SPI bus interface; GRAMS Lib Spec: 2.7; Supplier 1: Digikey; Supplier Part Number 1: M25P128-VMF6TP CT-ND
Y1 = OSC_590BD-BDG: TIM - OSC PROG 125MHz ~ 214.999MHz LVDS 3.3V 7PPM EN/DS - 6-SMD; Manufacturer #1: Silicon Labs; Current Rating: 100 mA (supply); Note: Spécifié la fréquence lors de la commande; Voltage rating: 3.3V (supply); Polarized: Yes; Value: ±7ppm (freq Stability), ±20ppm (freq stability total); Magnetic Material: UNKNOWN; GRAMS Lib Spec: 2.8; Manufacturer #2: *; Power Max: *; Part Number #1: 590BD-BDG; Part Number #2: *; HelpURL: https://www.silabs.com/documents/public/data-sheets/Si590-591.pdf; Supplier 1: Digi-Key; Supplier Part Number 1: 590BD-BDG-ND; Assembly Type: SMD; Temperature: -40°C ~ 85°C; Package: 6-SMD; CreatedBy/Date: from 590BD-CDG; Tolerance: *; VerifiedBy: Caroline Paulin / 3/10/2019; Cryo: UNKNOWN

## Sheet S7CAS-PLEIADES-CARTE-MERE_Pxx_CNA.SchDoc
size Tabloid; SheetNumber: 11; SheetTotal: 18; Sheet_Name: CNA; Size: 11x17
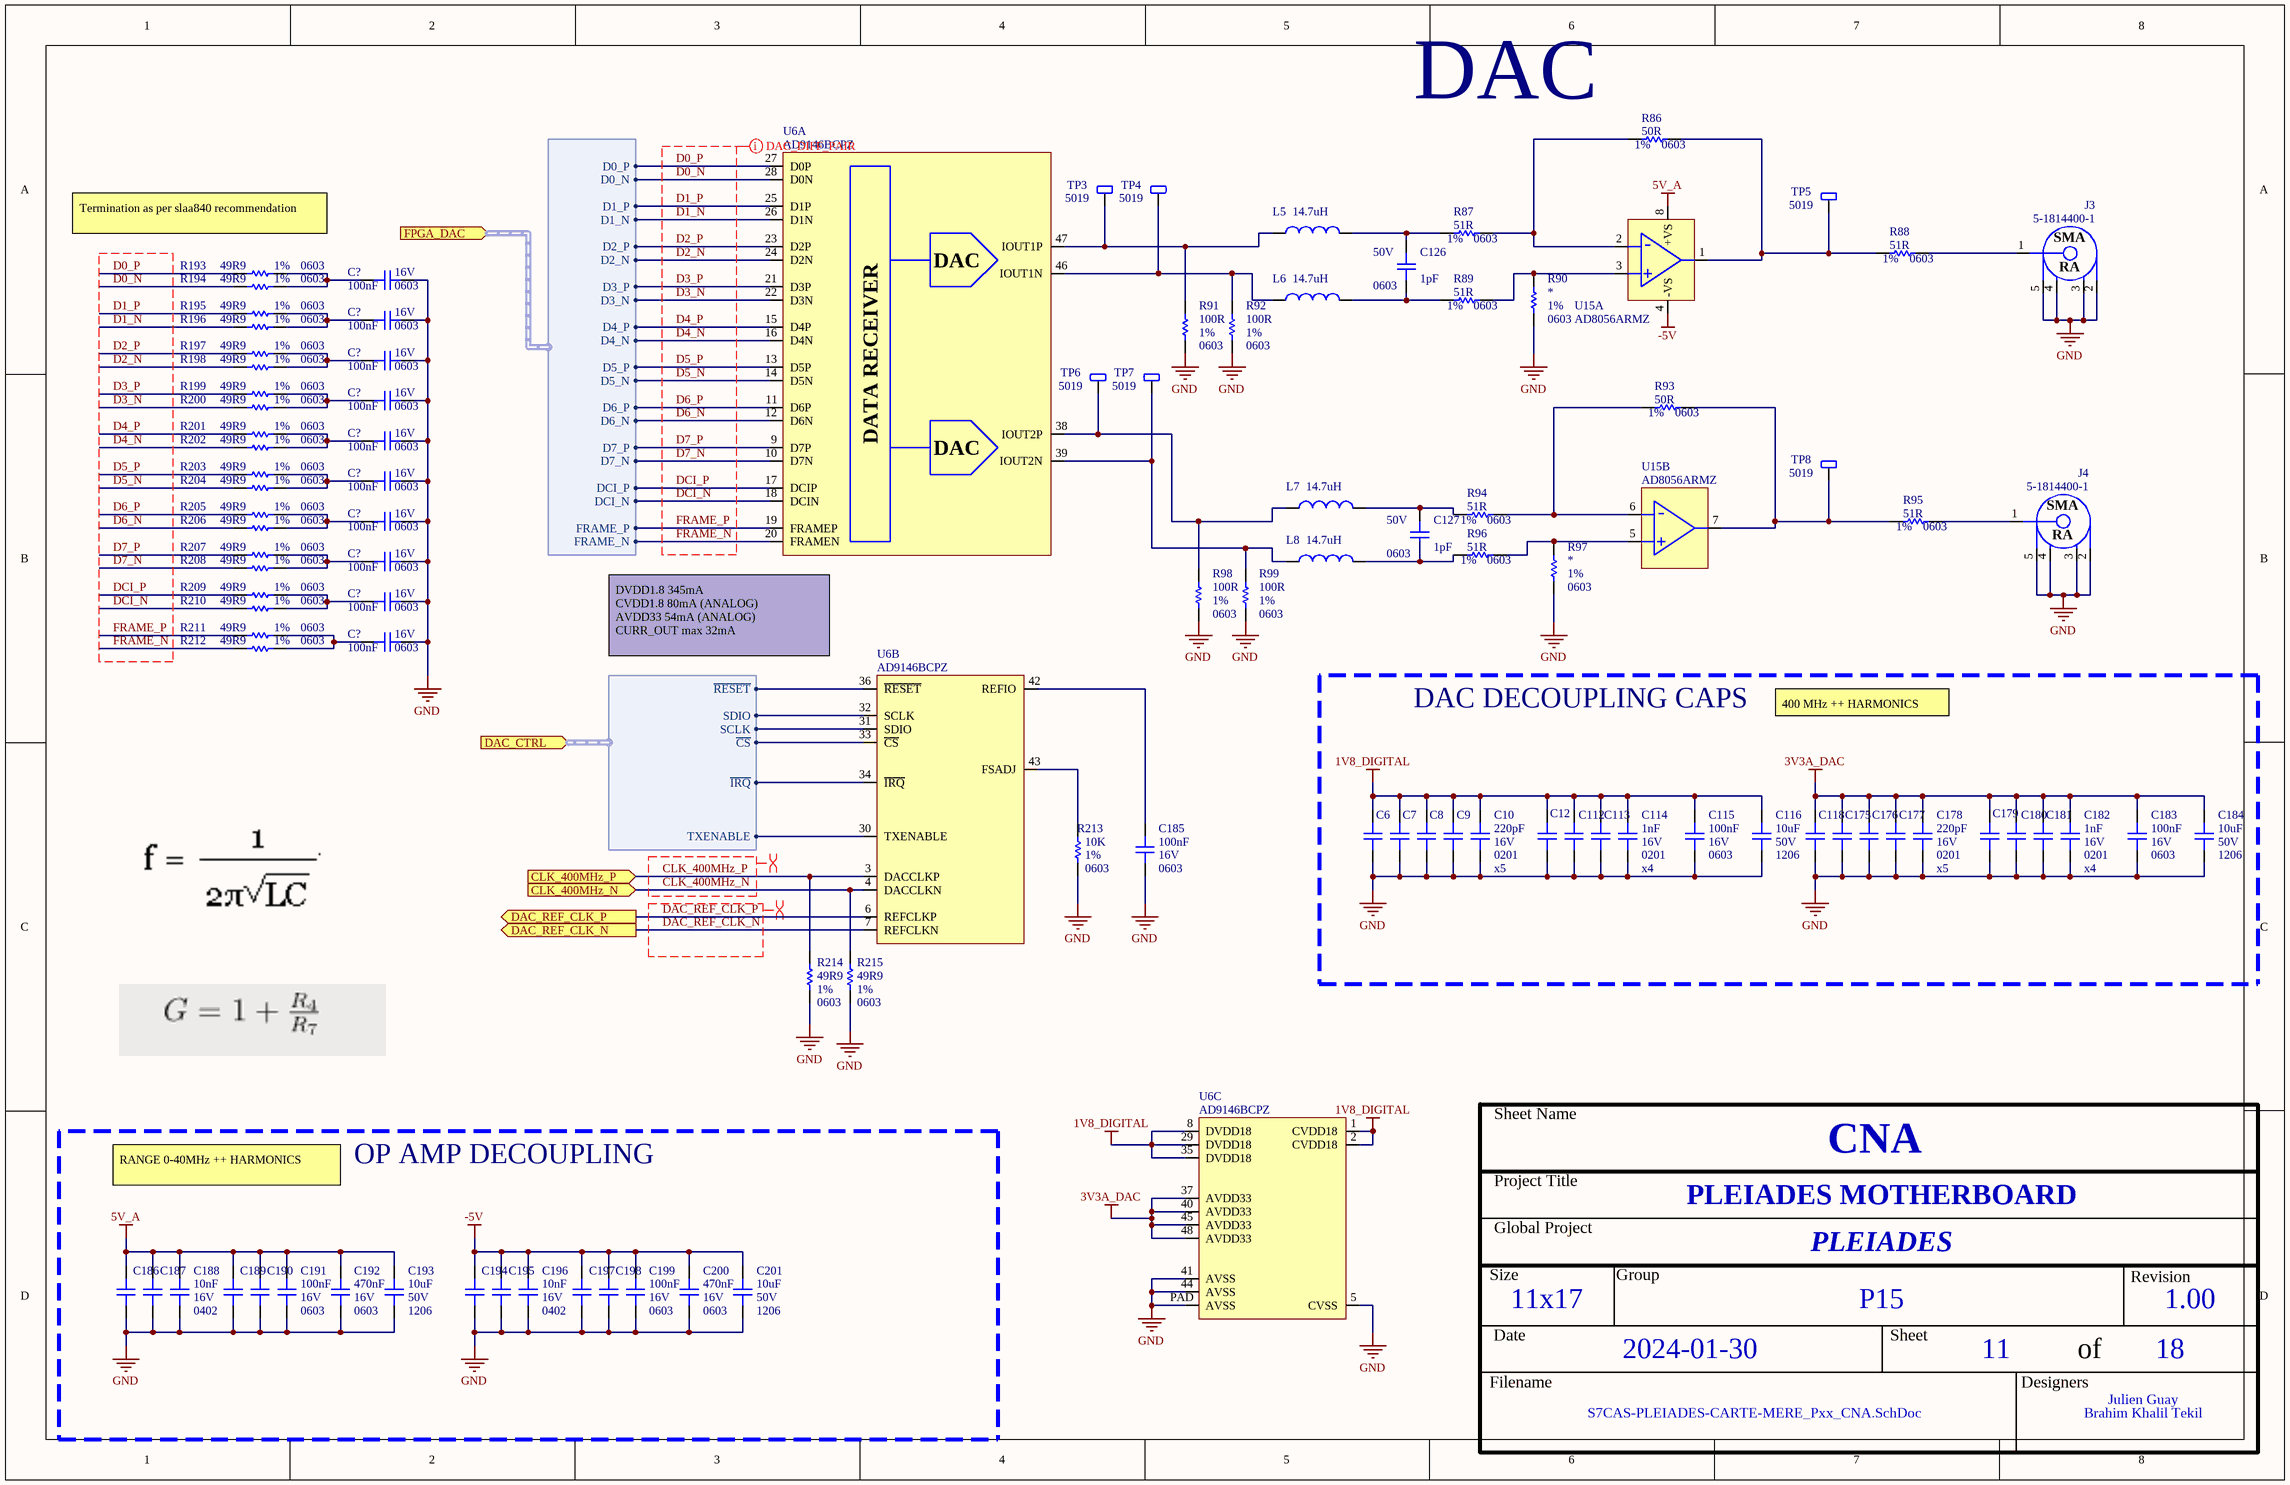
[diagram p9: S7CAS-PLEIADES-CARTE-MERE_Pxx_CNA.SchDoc]

### Parts
(Parts that share a designator on the sheet are numbered #1, #2 ... from top to bottom, then left to right.)
C6  CAP - 0201  [CAP_0201]  (value not drawn)
C7  CAP - 0201  [CAP_0201]  (value not drawn)
C8  CAP - 0201  [CAP_0201]  (value not drawn)
C9  CAP - 0201  [CAP_0201]  (value not drawn)
C10  value 220pF  Voltage: 16V  Package: 0201  [CAP_0201]  (hidden comment: CAP - 0201)
C12  CAP - 0201  [CAP_0201]  (value not drawn)
C112  CAP - 0201  [CAP_0201]  (value not drawn)
C113  CAP - 0201  [CAP_0201]  (value not drawn)
C114  value 1nF  Voltage: 16V  Package: 0201  [CAP_0201]  (hidden comment: CAP - 0201)
C115  value 100nF  Voltage: 16V  Package: 0603  [CAP_0603]  (hidden comment: CAP - 0603)
C116  value 10uF  Voltage: 50V  Package: 1206  [CAP_1206]  (hidden comment: CAP - 1206)
C118  CAP - 0201  [CAP_0201]  (value not drawn)
C126  value 1pF  Voltage: 50V  Package: 0603  [CAP_0603]  (hidden comment: CAP - 0603)
C127  value 1pF  Voltage: 50V  Package: 0603  [CAP_0603]  (hidden comment: CAP - 0603)
C175  CAP - 0201  [CAP_0201]  (value not drawn)
C176  CAP - 0201  [CAP_0201]  (value not drawn)
C177  CAP - 0201  [CAP_0201]  (value not drawn)
C178  value 220pF  Voltage: 16V  Package: 0201  [CAP_0201]  (hidden comment: CAP - 0201)
C179  CAP - 0201  [CAP_0201]  (value not drawn)
C180  CAP - 0201  [CAP_0201]  (value not drawn)
C181  CAP - 0201  [CAP_0201]  (value not drawn)
C182  value 1nF  Voltage: 16V  Package: 0201  [CAP_0201]  (hidden comment: CAP - 0201)
C183  value 100nF  Voltage: 16V  Package: 0603  [CAP_0603]  (hidden comment: CAP - 0603)
C184  value 10uF  Voltage: 50V  Package: 1206  [CAP_1206]  (hidden comment: CAP - 1206)
C185  value 100nF  Voltage: 16V  Package: 0603  [CAP_0603]  (hidden comment: CAP - 0603)
C186  CAP - 0402  [CAP_0402]  (value not drawn)
C187  CAP - 0402  [CAP_0402]  (value not drawn)
C188  value 10nF  Voltage: 16V  Package: 0402  [CAP_0402]  (hidden comment: CAP - 0402)
C189  CAP - 0603  [CAP_0603]  (value not drawn)
C190  CAP - 0603  [CAP_0603]  (value not drawn)
C191  value 100nF  Voltage: 16V  Package: 0603  [CAP_0603]  (hidden comment: CAP - 0603)
C192  value 470nF  Voltage: 16V  Package: 0603  [CAP_0603]  (hidden comment: CAP - 0603)
C193  value 10uF  Voltage: 50V  Package: 1206  [CAP_1206]  (hidden comment: CAP - 1206)
C194  CAP - 0402  [CAP_0402]  (value not drawn)
C195  CAP - 0402  [CAP_0402]  (value not drawn)
C196  value 10nF  Voltage: 16V  Package: 0402  [CAP_0402]  (hidden comment: CAP - 0402)
C197  CAP - 0603  [CAP_0603]  (value not drawn)
C198  CAP - 0603  [CAP_0603]  (value not drawn)
C199  value 100nF  Voltage: 16V  Package: 0603  [CAP_0603]  (hidden comment: CAP - 0603)
C200  value 470nF  Voltage: 16V  Package: 0603  [CAP_0603]  (hidden comment: CAP - 0603)
C201  value 10uF  Voltage: 50V  Package: 1206  [CAP_1206]  (hidden comment: CAP - 1206)
C?#1  value 100nF  Voltage: 16V  Package: 0603  [CAP_0603]  (hidden comment: CAP - 0603)
C?#2  value 100nF  Voltage: 16V  Package: 0603  [CAP_0603]  (hidden comment: CAP - 0603)
C?#3  value 100nF  Voltage: 16V  Package: 0603  [CAP_0603]  (hidden comment: CAP - 0603)
C?#4  value 100nF  Voltage: 16V  Package: 0603  [CAP_0603]  (hidden comment: CAP - 0603)
C?#5  value 100nF  Voltage: 16V  Package: 0603  [CAP_0603]  (hidden comment: CAP - 0603)
C?#6  value 100nF  Voltage: 16V  Package: 0603  [CAP_0603]  (hidden comment: CAP - 0603)
C?#7  value 100nF  Voltage: 16V  Package: 0603  [CAP_0603]  (hidden comment: CAP - 0603)
C?#8  value 100nF  Voltage: 16V  Package: 0603  [CAP_0603]  (hidden comment: CAP - 0603)
C?#9  value 100nF  Voltage: 16V  Package: 0603  [CAP_0603]  (hidden comment: CAP - 0603)
C?#10  value 100nF  Voltage: 16V  Package: 0603  [CAP_0603]  (hidden comment: CAP - 0603)
J3  5-1814400-1  [CONN_SMA_5-1814400-1]
J4  5-1814400-1  [CONN_SMA_5-1814400-1]
L5  value 14.7uH  [INDUCT_0603]  (hidden comment: INDUCTOR - 0603)
L6  value 14.7uH  [INDUCT_0603]  (hidden comment: INDUCTOR - 0603)
L7  value 14.7uH  [INDUCT_0603]  (hidden comment: INDUCTOR - 0603)
L8  value 14.7uH  [INDUCT_0603]  (hidden comment: INDUCTOR - 0603)
R86  value 50R  Package: 0603  Precision: 1%  [RES_0603]  (hidden comment: RES - 0603)
R87  value 51R  Package: 0603  Precision: 1%  [RES_0603]  (hidden comment: RES - 0603)
R88  value 51R  Package: 0603  Precision: 1%  [RES_0603]  (hidden comment: RES - 0603)
R89  value 51R  Package: 0603  Precision: 1%  [RES_0603]  (hidden comment: RES - 0603)
R90  Package: 0603  Precision: 1%  [RES_0603]  (hidden comment: RES - 0603)
R91  value 100R  Package: 0603  Precision: 1%  [RES_0603]  (hidden comment: RES - 0603)
R92  value 100R  Package: 0603  Precision: 1%  [RES_0603]  (hidden comment: RES - 0603)
R93  value 50R  Package: 0603  Precision: 1%  [RES_0603]  (hidden comment: RES - 0603)
R94  value 51R  Package: 0603  Precision: 1%  [RES_0603]  (hidden comment: RES - 0603)
R95  value 51R  Package: 0603  Precision: 1%  [RES_0603]  (hidden comment: RES - 0603)
R96  value 51R  Package: 0603  Precision: 1%  [RES_0603]  (hidden comment: RES - 0603)
R97  Package: 0603  Precision: 1%  [RES_0603]  (hidden comment: RES - 0603)
R98  value 100R  Package: 0603  Precision: 1%  [RES_0603]  (hidden comment: RES - 0603)
R99  value 100R  Package: 0603  Precision: 1%  [RES_0603]  (hidden comment: RES - 0603)
R193  value 49R9  Package: 0603  Precision: 1%  [RES_0603]  (hidden comment: RES - 0603)
R194  value 49R9  Package: 0603  Precision: 1%  [RES_0603]  (hidden comment: RES - 0603)
R195  value 49R9  Package: 0603  Precision: 1%  [RES_0603]  (hidden comment: RES - 0603)
R196  value 49R9  Package: 0603  Precision: 1%  [RES_0603]  (hidden comment: RES - 0603)
R197  value 49R9  Package: 0603  Precision: 1%  [RES_0603]  (hidden comment: RES - 0603)
R198  value 49R9  Package: 0603  Precision: 1%  [RES_0603]  (hidden comment: RES - 0603)
R199  value 49R9  Package: 0603  Precision: 1%  [RES_0603]  (hidden comment: RES - 0603)
R200  value 49R9  Package: 0603  Precision: 1%  [RES_0603]  (hidden comment: RES - 0603)
R201  value 49R9  Package: 0603  Precision: 1%  [RES_0603]  (hidden comment: RES - 0603)
R202  value 49R9  Package: 0603  Precision: 1%  [RES_0603]  (hidden comment: RES - 0603)
R203  value 49R9  Package: 0603  Precision: 1%  [RES_0603]  (hidden comment: RES - 0603)
R204  value 49R9  Package: 0603  Precision: 1%  [RES_0603]  (hidden comment: RES - 0603)
R205  value 49R9  Package: 0603  Precision: 1%  [RES_0603]  (hidden comment: RES - 0603)
R206  value 49R9  Package: 0603  Precision: 1%  [RES_0603]  (hidden comment: RES - 0603)
R207  value 49R9  Package: 0603  Precision: 1%  [RES_0603]  (hidden comment: RES - 0603)
R208  value 49R9  Package: 0603  Precision: 1%  [RES_0603]  (hidden comment: RES - 0603)
R209  value 49R9  Package: 0603  Precision: 1%  [RES_0603]  (hidden comment: RES - 0603)
R210  value 49R9  Package: 0603  Precision: 1%  [RES_0603]  (hidden comment: RES - 0603)
R211  value 49R9  Package: 0603  Precision: 1%  [RES_0603]  (hidden comment: RES - 0603)
R212  value 49R9  Package: 0603  Precision: 1%  [RES_0603]  (hidden comment: RES - 0603)
R213  value 10K  Package: 0603  Precision: 1%  [RES_0603]  (hidden comment: RES - 0603)
R214  value 49R9  Package: 0603  Precision: 1%  [RES_0603]  (hidden comment: RES - 0603)
R215  value 49R9  Package: 0603  Precision: 1%  [RES_0603]  (hidden comment: RES - 0603)
TP3  5019  [TPO_SMD_5019]
TP4  5019  [TPO_SMD_5019]
TP5  5019  [TPO_SMD_5019]
TP6  5019  [TPO_SMD_5019]
TP7  5019  [TPO_SMD_5019]
TP8  5019  [TPO_SMD_5019]
U6  AD9146BCPZ  [DAC_AD9146BCPZ]  (parts A,B,C of 3)
U15  AD8056ARMZ  [OPAMP_AD8056ARMZ]  (parts A,B of 2)

### Blocks framed on the sheet
DAC DECOUPLING CAPS: C6-C10 C12 C112-C116 C118 C175-C184
OP AMP DECOUPLING: C186-C201

### Ports
CLK_400MHz_N (in, see S7CAS-PLEIADES-CARTE-MERE_Pxx_FLASH_PHY_CLOCK[5A]), CLK_400MHz_P (in, see S7CAS-PLEIADES-CARTE-MERE_Pxx_FLASH_PHY_CLOCK[5A]), DAC_CTRL (in, harness DAC_CTRL_HARNESS, see S7CAS-PLEIADES-CARTE-MERE_Pxx_FPGA_bank2_4[6A]), DAC_REF_CLK_N (out, see S7CAS-PLEIADES-CARTE-MERE_Pxx_FPGA_bank2_4[3C]), DAC_REF_CLK_P (out, see S7CAS-PLEIADES-CARTE-MERE_Pxx_FPGA_bank2_4[3C]), FPGA_DAC (in, harness DAC_HARNESS, see S7CAS-PLEIADES-CARTE-MERE_Pxx_FPGA_bank2_4[6B])

### Harnesses
DAC_HARNESS: D0_P, D1_P, D2_P, D3_P, D4_P, D5_P, D6_P, D7_P, DCI_P, DCI_N, FRAME_P, FRAME_N, D2_N, D4_N, D6_N, D7_N, D5_N, D1_N, D3_N, D0_N
DAC_CTRL_HARNESS: ~{RESET}, SDIO, ~{CS}, SCLK, ~{IRQ}, TXENABLE

### Nets
1V8_DIGITAL: C6.2 C7.2 C8.2 C9.2 C10.2 C12.2 C112.2 C113.2 C114.2 C115.2 C116.2 U6.1(CVDD18) U6.2(CVDD18) U6.8(DVDD18) U6.29(DVDD18) U6.35(DVDD18)
3V3A_DAC: C118.2 C175.2 C176.2 C177.2 C178.2 C179.2 C180.2 C181.2 C182.2 C183.2 C184.2 U6.37(AVDD33) U6.40(AVDD33) U6.45(AVDD33) U6.48(AVDD33)
5V_A: C186.2 C187.2 C188.2 C189.2 C190.2 C191.2 C192.2 C193.2 U15.8(+VS)
-5V: C194.2 C195.2 C196.2 C197.2 C198.2 C199.2 C200.2 C201.2 U15.4(-VS)
GND: C6.1 C7.1 C8.1 C9.1 C10.1 C12.1 C112.1 C113.1 C114.1 C115.1 C116.1 C118.1 C175.1 C176.1 C177.1 C178.1 C179.1 C180.1 C181.1 C182.1 C183.1 C184.1 C185.1 C186.1 C187.1 C188.1 C189.1 C190.1 C191.1 C192.1 C193.1 C194.1 C195.1 C196.1 C197.1 C198.1 C199.1 C200.1 C201.1 C?#1.1 C?#2.1 C?#3.1 C?#4.1 C?#5.1 C?#6.1 C?#7.1 C?#8.1 C?#9.1 C?#10.1 J3.2 J3.3 J3.4 J3.5 J4.2 J4.3 J4.4 J4.5 R90.1 R91.1 R92.1 R97.1 R98.1 R99.1 R213.1 R214.1 R215.1 U6.5(CVSS) U6.41(AVSS) U6.44(AVSS) U6.PAD(AVSS)  [project net nCS]
CLK_400MHz_N: R215.2 U6.4(DACCLKN) ; port CLK_400MHz_N
CLK_400MHz_P: R214.2 U6.3(DACCLKP) ; port CLK_400MHz_P
D0_N: R194.2 U6.28(D0N) ; port FPGA_DAC.D0_N
D0_P: R193.2 U6.27(D0P) ; port FPGA_DAC.D0_P
D1_N: R196.2 U6.26(D1N) ; port FPGA_DAC.D1_N
D1_P: R195.2 U6.25(D1P) ; port FPGA_DAC.D1_P
D2_N: R198.2 U6.24(D2N) ; port FPGA_DAC.D2_N
D2_P: R197.2 U6.23(D2P) ; port FPGA_DAC.D2_P
D3_N: R200.2 U6.22(D3N) ; port FPGA_DAC.D3_N
D3_P: R199.2 U6.21(D3P) ; port FPGA_DAC.D3_P
D4_N: R202.2 U6.16(D4N) ; port FPGA_DAC.D4_N
D4_P: R201.2 U6.15(D4P) ; port FPGA_DAC.D4_P
D5_N: R204.2 U6.14(D5N) ; port FPGA_DAC.D5_N
D5_P: R203.2 U6.13(D5P) ; port FPGA_DAC.D5_P
D6_N: R206.2 U6.12(D6N) ; port FPGA_DAC.D6_N
D6_P: R205.2 U6.11(D6P) ; port FPGA_DAC.D6_P
D7_N: R208.2 U6.10(D7N) ; port FPGA_DAC.D7_N
D7_P: R207.2 U6.9(D7P) ; port FPGA_DAC.D7_P
DAC_REF_CLK_N: U6.7(REFCLKN) ; port DAC_REF_CLK_N
DAC_REF_CLK_P: U6.6(REFCLKP) ; port DAC_REF_CLK_P
DCI_N: R210.2 U6.18(DCIN) ; port FPGA_DAC.DCI_N
DCI_P: R209.2 U6.17(DCIP) ; port FPGA_DAC.DCI_P
FRAME_N: R212.2 U6.20(FRAMEN) ; port FPGA_DAC.FRAME_N
FRAME_P: R211.2 U6.19(FRAMEP) ; port FPGA_DAC.FRAME_P
NetC126_1: C126.1 L6.2 R89.2
NetC126_2: C126.2 L5.2 R87.2
NetC127_1: C127.1 L8.2 R96.2
NetC127_2: C127.2 L7.2 R94.2
NetC185_2: C185.2 U6.42(REFIO)
NetC?#1_2: C?#1.2 R193.1 R194.1
NetC?#2_2: C?#2.2 R195.1 R196.1
NetC?#3_2: C?#3.2 R197.1 R198.1
NetC?#4_2: C?#4.2 R199.1 R200.1
NetC?#5_2: C?#5.2 R201.1 R202.1
NetC?#6_2: C?#6.2 R203.1 R204.1
NetC?#7_2: C?#7.2 R205.1 R206.1
NetC?#8_2: C?#8.2 R207.1 R208.1
NetC?#9_2: C?#9.2 R209.1 R210.1
NetC?#10_2: C?#10.2 R211.1 R212.1
NetJ3_1: J3.1 R88.1
NetJ4_1: J4.1 R95.1
NetL5_1: L5.1 R91.2 TP3.1 U6.47(IOUT1P)
NetL6_1: L6.1 R92.2 TP4.1 U6.46(IOUT1N)
NetL7_1: L7.1 R98.2 TP6.1 U6.38(IOUT2P)
NetL8_1: L8.1 R99.2 TP7.1 U6.39(IOUT2N)
NetR86_1: R86.1 R88.2 TP5.1 U15.1(OUT1)
NetR86_2: R86.2 R87.1 U15.2(-IN1)
NetR89_1: R89.1 R90.2 U15.3(+IN1)
NetR93_1: R93.1 R95.2 TP8.1 U15.7(OUT2)
NetR93_2: R93.2 R94.1 U15.6(-IN2)
NetR96_1: R96.1 R97.2 U15.5(+IN2)
NetR213_2: R213.2 U6.43(FSADJ)
NetU1_AA11: U6.34(~{IRQ}) ; port DAC_CTRL.~{IRQ}
NetU1_AA12: U6.31(SDIO) ; port DAC_CTRL.SCLK
NetU1_AB13: U6.32(SCLK) ; port DAC_CTRL.SDIO
NetU1_AC11: U6.30(TXENABLE) ; port DAC_CTRL.TXENABLE
NetU1_AC12: U6.33(~{CS}) ; port DAC_CTRL.~{CS}
NetU1_Y13: U6.36(~{RESET}) ; port DAC_CTRL.~{RESET}

### Layout directives
differential pair; differential pair class CLK_400MHz_PAIR: CLK_400MHz_N, CLK_400MHz_P, DAC_REF_CLK_N, DAC_REF_CLK_P
differential pair: D0_N, D0_P, D1_N, D1_P, D2_N, D2_P, D3_N, D3_P, D4_N, D4_P, D5_N, D5_P, D6_N, D6_P, D7_N, D7_P, DCI_N, DCI_P, FRAME_N, FRAME_P

### Notes on the sheet
- DAC
- Termination as per slaa840 recommendation
- (near U6) DVDD1.8 345mA
  CVDD1.8 80mA (ANALOG)
  AVDD33 54mA (ANALOG)
  CURR_OUT max 32mA
- 400 MHz ++ HARMONICS
- (near C10) x5
- (near C114) x4
- (near C178) x5
- (near C182) x4
- RANGE 0-40MHz ++ HARMONICS
- Sheet Name
- Project Title
- Global Project
- Size
- Group
- Revision
- Date
- Sheet
- of
- Filename
- Designers
- (in symbol CONN_SMA_5-1814400-1) SMA; RA
- (in symbol DAC_AD9146BCPZ, part A) DAC; DATA RECEIVER

### Library data of the parts
C6-C9 C118 C175-C177 = CAP - 0201: as C106 on sheet S7CAS-PLEIADES-CARTE-MERE_Pxx_FLASH_PHY_CLOCK; Current: *; CreatedBy: Jonathan Bouchard; Power: *; Package: 0201; Supplier 1: Arrow Electronics; Supplier Part Number 1: GRM033R71C221KA01D
C10 C114 C178 C182 = CAP - 0201: Precision: 10%; Current: *; CreatedBy: Jonathan Bouchard; Power: *
  C10 C178: Supplier 1: Arrow Electronics; Supplier Part Number 1: GRM033R71C221KA01D
  C114 C182: Supplier 1: Avnet; Supplier Part Number 1: GRM033R71C102KA01J
C12 C112 C113 C179-C181 = CAP - 0201: Precision: 10%; Voltage: 16V; Value: 1nF; Current: *; CreatedBy: Jonathan Bouchard; Power: *; Package: 0201; Supplier 1: Avnet; Supplier Part Number 1: GRM033R71C102KA01J
C115 C126 C127 C183 C185 C191 C192 C199 C200 C?#1-C?#10 = CAP - 0603: Precision: 10%; Current: *; CreatedBy: Jonathan Bouchard; Power: *
  C115 C183 C185 C191 C199 C?#1-C?#10: Supplier 1: Arrow Electronics; Supplier Part Number 1: CL10B104KO8NNNC
  C192 C200: Supplier 1: Arrow Electronics; Supplier Part Number 1: C1608X7R1C474K080AC
C116 C184 C193 C201 = CAP - 1206: Precision: 10%; Current: *; CreatedBy: Jonathan Bouchard; Power: *; Supplier 1: Avnet; Supplier Part Number 1: CL31A106MBHNNNE
C186 C187 C194 C195 = CAP - 0402: Precision: 10%; Voltage: 16V; Value: 10nF; Current: *; CreatedBy: Jonathan Bouchard; Power: *; Package: 0402; Supplier 1: Arrow Electronics; Supplier Part Number 1: GRM155R61A224KE19D
C188 C196 = CAP - 0402: Precision: 10%; Current: *; CreatedBy: Jonathan Bouchard; Power: *; Supplier 1: Arrow Electronics; Supplier Part Number 1: GRM155R61A224KE19D
C189 C190 C197 C198 = CAP - 0603: Precision: 10%; Voltage: 16V; Value: 100nF; Current: *; CreatedBy: Jonathan Bouchard; Power: *; Package: 0603; Supplier 1: Arrow Electronics; Supplier Part Number 1: CL10B104KO8NNNC
J3 J4 = CONN_SMA_5-1814400-1: CONN -  SMA JACK R/A 50 OHM - TH; Mfg: TE Connectivity AMP Connectors; Voltage: *; Current: *; Power: *; Mfg Part Number: 5-1814400-1; HelpURL: http://www.te.com/commerce/DocumentDelivery/DDEController?Action=srchrtrv&DocNm=1814400&DocType=Customer+Drawing&DocLang=English; CreatedBy: Jonathan Bouchard; Temperature: -55°C ~ 85°C; Value: *; Precision: *; Package: TH-5; Supplier 1: Digikey; Supplier Part Number 1: A97593-ND
L5-L8 = INDUCT - 0603: GRAMS Lib Spec: 2.7; Saturation Val: [SATURATION]
TP3-TP8 = TPO_SMD_5019: TPO - PC TEST POINT MINI - SMD; Manufacturer #1: Keystone Electronics; Value: 3.81mm x 2.03mm; Polarized: No; Magnetic Material: UNKNOWN; GRAMS Lib Spec: 2.8; Current Rating: *; Manufacturer #2: *; Note: *; Power Max: *; Part Number #2: *; HelpURL: https://www.digikey.ca/product-detail/en/keystone-electronics/5019/36-5019CT-ND/3907344; Supplier 1: Digi-Key; Supplier Part Number 1: 36-5019CT-ND; Assembly Type: SMD; Part Number #1: 5019; Package: SMD; CreatedBy/Date: Olivier Bernard / 5/12/2017; Temperature: *; Tolerance: *; VerifiedBy: Caroline Paulin / 5 juillet 2018; Voltage Rating: *; Cryo: UNKNOWN
U6 = DAC_AD9146BCPZ: DAC - 16BIT SRL HIGH SPEED - QFN-48; Voltage: 3.13 V ~ 3.47 V / 1.71 V ~ 1.89 V; Mfg: Analog Devices Inc.; Current: *; Power: *; Mfg Part Number: AD9146BCPZ; HelpURL: http://www.analog.com/media/en/technical-documentation/data-sheets/AD9146.PDF; CreatedBy: Jonathan Bouchard; Temperature: -40°C ~ 85°C; Value: *; Precision: 16 Bit; Package: QFN-48; Supplier 1: Mouser; Supplier Part Number 1: 584-AD9146BCPZ
U15 = OPAMP_AD8056ARMZ: OPAMP - VFB 300MHZ - 8MSOP; Voltage: 8 V ~ 12 V, ±4 V ~ 6 V; Current: 60mA; Mfg: Analog Devices; Power: *; Mfg Part Number: AD8056ARMZ; HelpURL: http://www.analog.com/media/en/technical-documentation/data-sheets/AD8055_8056.pdf; CreatedBy: Jonathan Bouchard; Temperature: -40°C ~ 125°C; Value: *; Precision: *; Package: MSOP-8; Supplier 1: Digikey; Supplier Part Number 1: AD8056ARMZ-REEL7CT-ND
R86-R99 R193-R215 = RES - 0603: Current: *; CreatedBy: Jonathan Bouchard
  R90 R97: Value: *
  R193-R212 R214 R215: Supplier 1: Mouser; Supplier Part Number 1: 667-ERJ-3EKF49R9V
  R213: Supplier 1: Arrow Electronics; Supplier Part Number 1: RMCF0603FT10K0